# Altium project Evaluation Board.PrjPCB (part 2 of 3)

## Sheet RTC.SchDoc: Evaluation Board 3.2
size A3; Organization: Toradex AG; Address1: Altsagenstrasse 5; Address2: Horw; Address3: 6048; Address4: Switzerland; DocumentNumber: 5; Revision: V3.2; SheetNumber: 5; SheetTotal: 23; PageSetup: Record=PageOptions|CenterHorizontal=True|CenterVertical=True|PrintScale=0.73|XCorrection=1.00|YCorrection=1.00|PrintKind=0|BorderSize=5000000|LeftOffset=0|BottomOffset=0|Orientation=2|PaperLength=1000|PaperWidth=1000|Scale=100|PaperSource=7|PrintQuality=-4|MediaType=1|DitherType=10|PaperKind=A4|PrintScaleMode=1
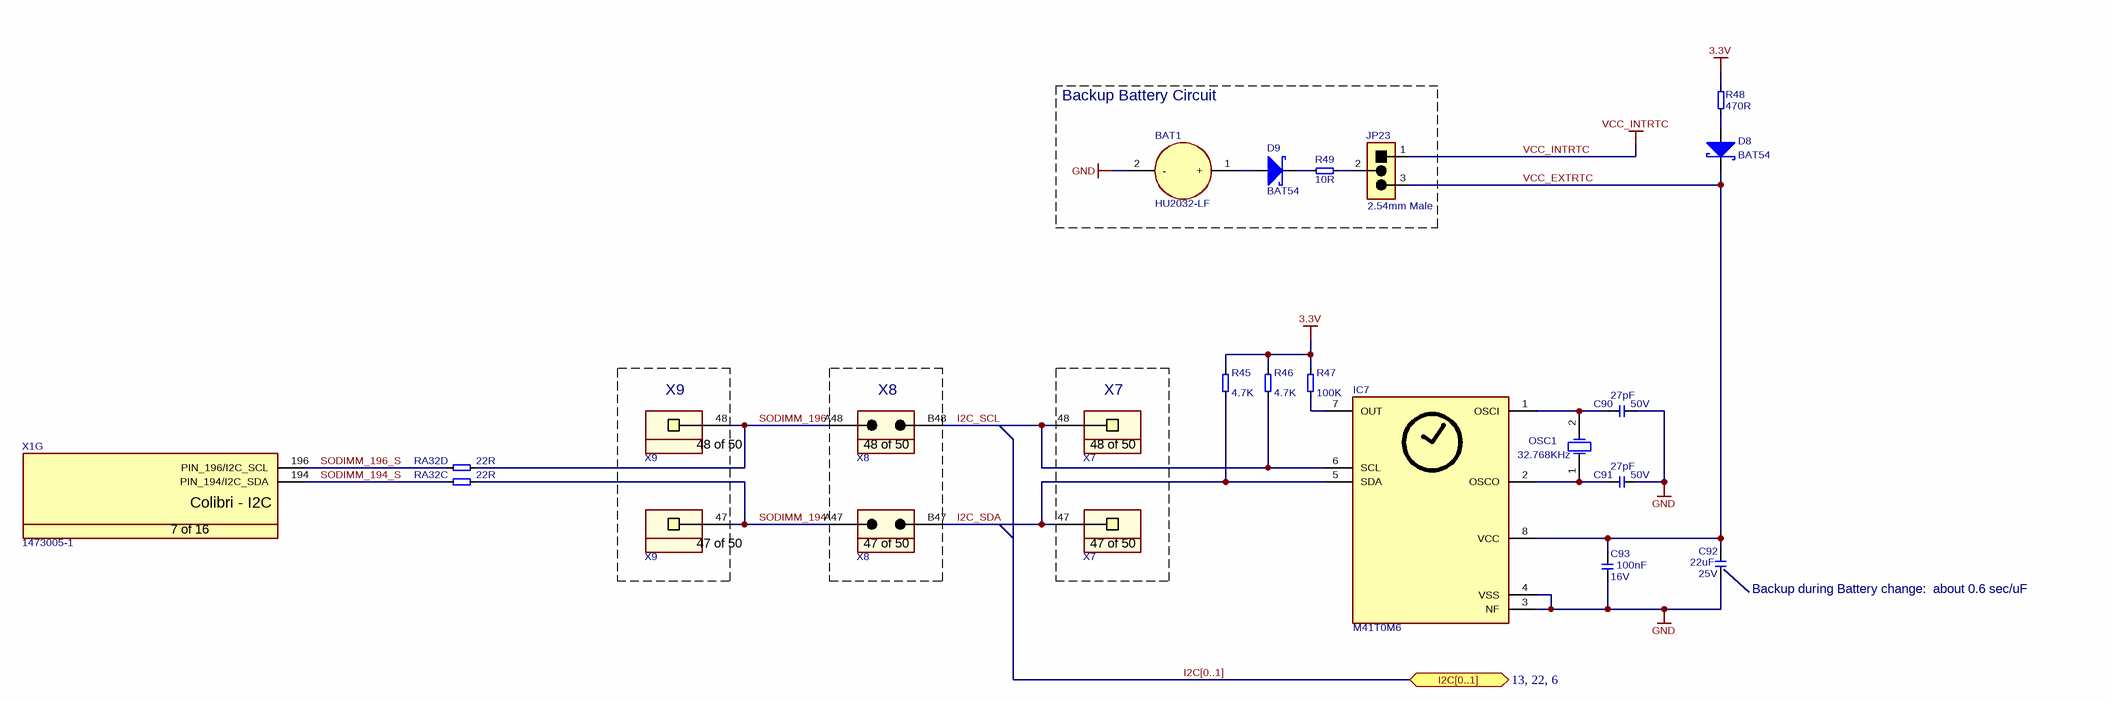
[diagram p8: RTC.SchDoc]

### Parts
BAT1  HU2032-LF  [T_Renata_HU2032-LF]
C90  Rating: 50V  [T_CAPC0603X33N]  (hidden comment: 27pF)
C91  Rating: 50V  [T_CAPC0603X33N]  (hidden comment: 27pF)
C92  Rating: 25V  [CAPC3225X160N]  (hidden comment: 22uF)
C93  Rating: 16V  [T_CAPC0603X33N]  (hidden comment: 100nF)
D8  BAT54  [SOT95P230X110-3N]
D9  BAT54  [SOT95P230X110-3N]
IC7  M41T0M6  [SOIC127P600X173-8N]
JP23  826936-3  [T_TYCO_826936-3]  (value not drawn)
OSC1  value 32.768KHz  [T_MC_CC4V-T1A]  (hidden comment: CC4V-T1A)
R45  4.7K  [t_RESC0603X30N]
R46  4.7K  [t_RESC0603X30N]
R47  100K  [t_RESC0603X30N]
R48  470R  [T_RESC0603X30N]
R49  10R  [t_RESC0603X30N]
RA32  22R  [T_Resistor_Array_X4]  (parts C,D of 4)
X1  Manufacturer Part No.: 1473005-1  [T_Tyco_1473005-1]  (hidden comment: CON-Tyco-1473005-1-200-0.6mm)  (part G of 16)
X7  SSW-110-01-G-S  [T_Samtec_SSW-110-01-G-S]  (value not drawn)  (parts 47,48 of 50)
X8  TSW-110-07-G-D  [T_Samtec_TSW-110-07-G-D]  (value not drawn)  (parts 47,48 of 50)
X9  SSW-110-01-G-S  [T_Samtec_SSW-110-01-G-S]  (value not drawn)  (parts 47,48 of 50)

### Blocks framed on the sheet
Backup Battery Circuit: BAT1 D9 JP23 R49
X9: X9
X8: X8
X7: X7

### Ports
I2C[0..1] (bidir, see 13, 22, 6)

### Nets
3.3V: R45.2 R46.2 R47.2 R48.2
GND: BAT1.2(-) C90.2 C91.2 C92.1 C93.1 IC7.3(NF) IC7.4(VSS)
VCC_INTRTC: JP23.1
I2C_SCL: IC7.6(SCL) R46.1 X7.48 X8.B48
I2C_SDA: IC7.5(SDA) R45.1 X7.47 X8.B47
SODIMM_194: RA32.7 X8.A47 X9.47
SODIMM_194_S: RA32.3 X1.194(PIN_194/I2C_SDA)
SODIMM_196: RA32.8 X8.A48 X9.48
SODIMM_196_S: RA32.4 X1.196(PIN_196/I2C_SCL)
VCC_EXTRTC: C92.2 C93.2 D8.3 IC7.8(VCC) JP23.3
NetBAT1_1: BAT1.1(+) D9.1
NetC90_1: C90.1 IC7.1(OSCI) OSC1.2(OSC2)
NetC91_1: C91.1 IC7.2(OSCO) OSC1.1(OSC1)
NetD8_1: D8.1 R48.1
NetD9_3: D9.3 R49.1
NetIC7_7: IC7.7(OUT) R47.1
NetJP23_2: JP23.2 R49.2

### Buses and harness runs
bus I2C[0..1] = port I2C[0..1]

### Notes on the sheet
- (near JP23) 2.54mm Male
- (near C92) Backup during Battery change:  about 0.6 sec/uF
- Title
- Size:
- Date:
- A3
- Number:
- Time:
- Revision:
- Sheet
- of
- File:
- (in symbol CON-Samtec-SSW-110-01-G-S, part 47) 47 of 50
- (in symbol CON-Samtec-SSW-110-01-G-S, part 48) 48 of 50
- (in symbol CON-Samtec-TSW-110-07-G-D, part 47) 47 of 50
- (in symbol CON-Samtec-TSW-110-07-G-D, part 48) 48 of 50
- (in symbol CON-Tyco-1473005-1-200-0.6mm, part G) Colibri - I2C; 7 of 16

### Library data of the parts
BAT1 = BAT-Renata-HU2032-LF: C2032 Battery Holder; Manufacturer Name: Renata; Manufacturer Part No.: HU2032-LF
C90 C91 = C-NPO-27pF-50V-5%-0603: Capacitor Ceramic NPO 27pF 50V 5% 0603; Tolerance: 5%; Type: NPO; Value: 27pF
C92 = C-X5R-22uF-25V-20%-1210: Capacitor Ceramic X5R 22uF 25V 20% 1210; Tolerance: 20%; Type: X5R; Value: 22uF
C93 = C-X7R-100nF-16V-10%-0603: Capacitor Ceramic X7R 100nF 16V 10% 0603; Tolerance: 10%; Type: X7R; Value: 100nF
D8 D9 = D-Philips-BAT54-Schottky: BAT54 Schottky Diode; Manufacturer Name: Philips; Manufacturer Part No.: BAT54
IC7 = IC-ST-M41T0M6: RTC M41T0M6; Manufacturer Name: ST; Manufacturer Part No.: M41T0M6
JP23 = CON-Tyco-826936-3-1X3-2.54mm-JP_1: Jumper, 3-Pin; Manufacturer Name: Tyco; No. of ways: 1X3; Pitch: 2.54mm; Manufacturer Part No.: 826936-3
OSC1 = OSC-MC-CC4V-T1A-32.768KHz-30ppm-5x1.9mm: Quartz 32.768kHz; Manufacturer Name: Micro Crystal; Tolerance: 30ppm; Manufacturer Part No.: CC4V-T1A
R45 R46 = R-4.7kR-63mW-5%-0603: Resistor 4.7 Kohm 63mW 5% 0603; Value: 4.7KR; Rating: 63mW; Tolerance: 5%
R47 = R-100KR-63mW-5%-0603: as R141 on sheet Extension; Rating: 63mW; Tolerance: 5%
R48 = R-470R-63mW-5%-0603: Resistor 470 ohm 63mW 5% 0603; Rating: 63mW; Tolerance: 5%; Value: 470R
R49 = R-10R-63mW-5%-0603: Resistor 10 ohm 63mW 5% 0603; Rating: 63mW; Tolerance: 5%; Value: 10R
RA32 = RA-22R-63mW-5%-1206-div: Resistor Array 22 R 63mW 5% 1206; Tolerance: 5%; Power Dissipation: 63mW; Value: 22R
X1 = CON-Tyco-1473005-1-200-0.6mm: as X1 on sheet Generic_Display
X7 X9 = CON-Samtec-SSW-110-01-G-S: as X10 on sheet SDCard; Pitch: 2.54mm; No. of ways: 1x50; Manufacturer Part No.: SSW-110-01-G-S
X8 = CON-Samtec-TSW-110-07-G-D: as X11 on sheet SDCard; Pitch: 2.54mm; No. of ways: 2x50; Manufacturer Part No.: TSW-110-07-G-D

## Sheet VGA.SchDoc: Evaluation Board 3.2
size A3; Organization: Toradex AG; Address1: Altsagenstrasse 5; Address2: Horw; Address3: 6048; Address4: Switzerland; DocumentNumber: 14; Revision: V3.2; SheetNumber: 14; SheetTotal: 23; PageSetup: Record=PageOptions|CenterHorizontal=True|CenterVertical=True|PrintScale=0.73|XCorrection=1.00|YCorrection=1.00|PrintKind=0|BorderSize=5000000|LeftOffset=0|BottomOffset=0|Orientation=2|PaperLength=1000|PaperWidth=1000|Scale=100|PaperSource=7|PrintQuality=-4|MediaType=1|DitherType=10|PaperKind=A4|PrintScaleMode=1
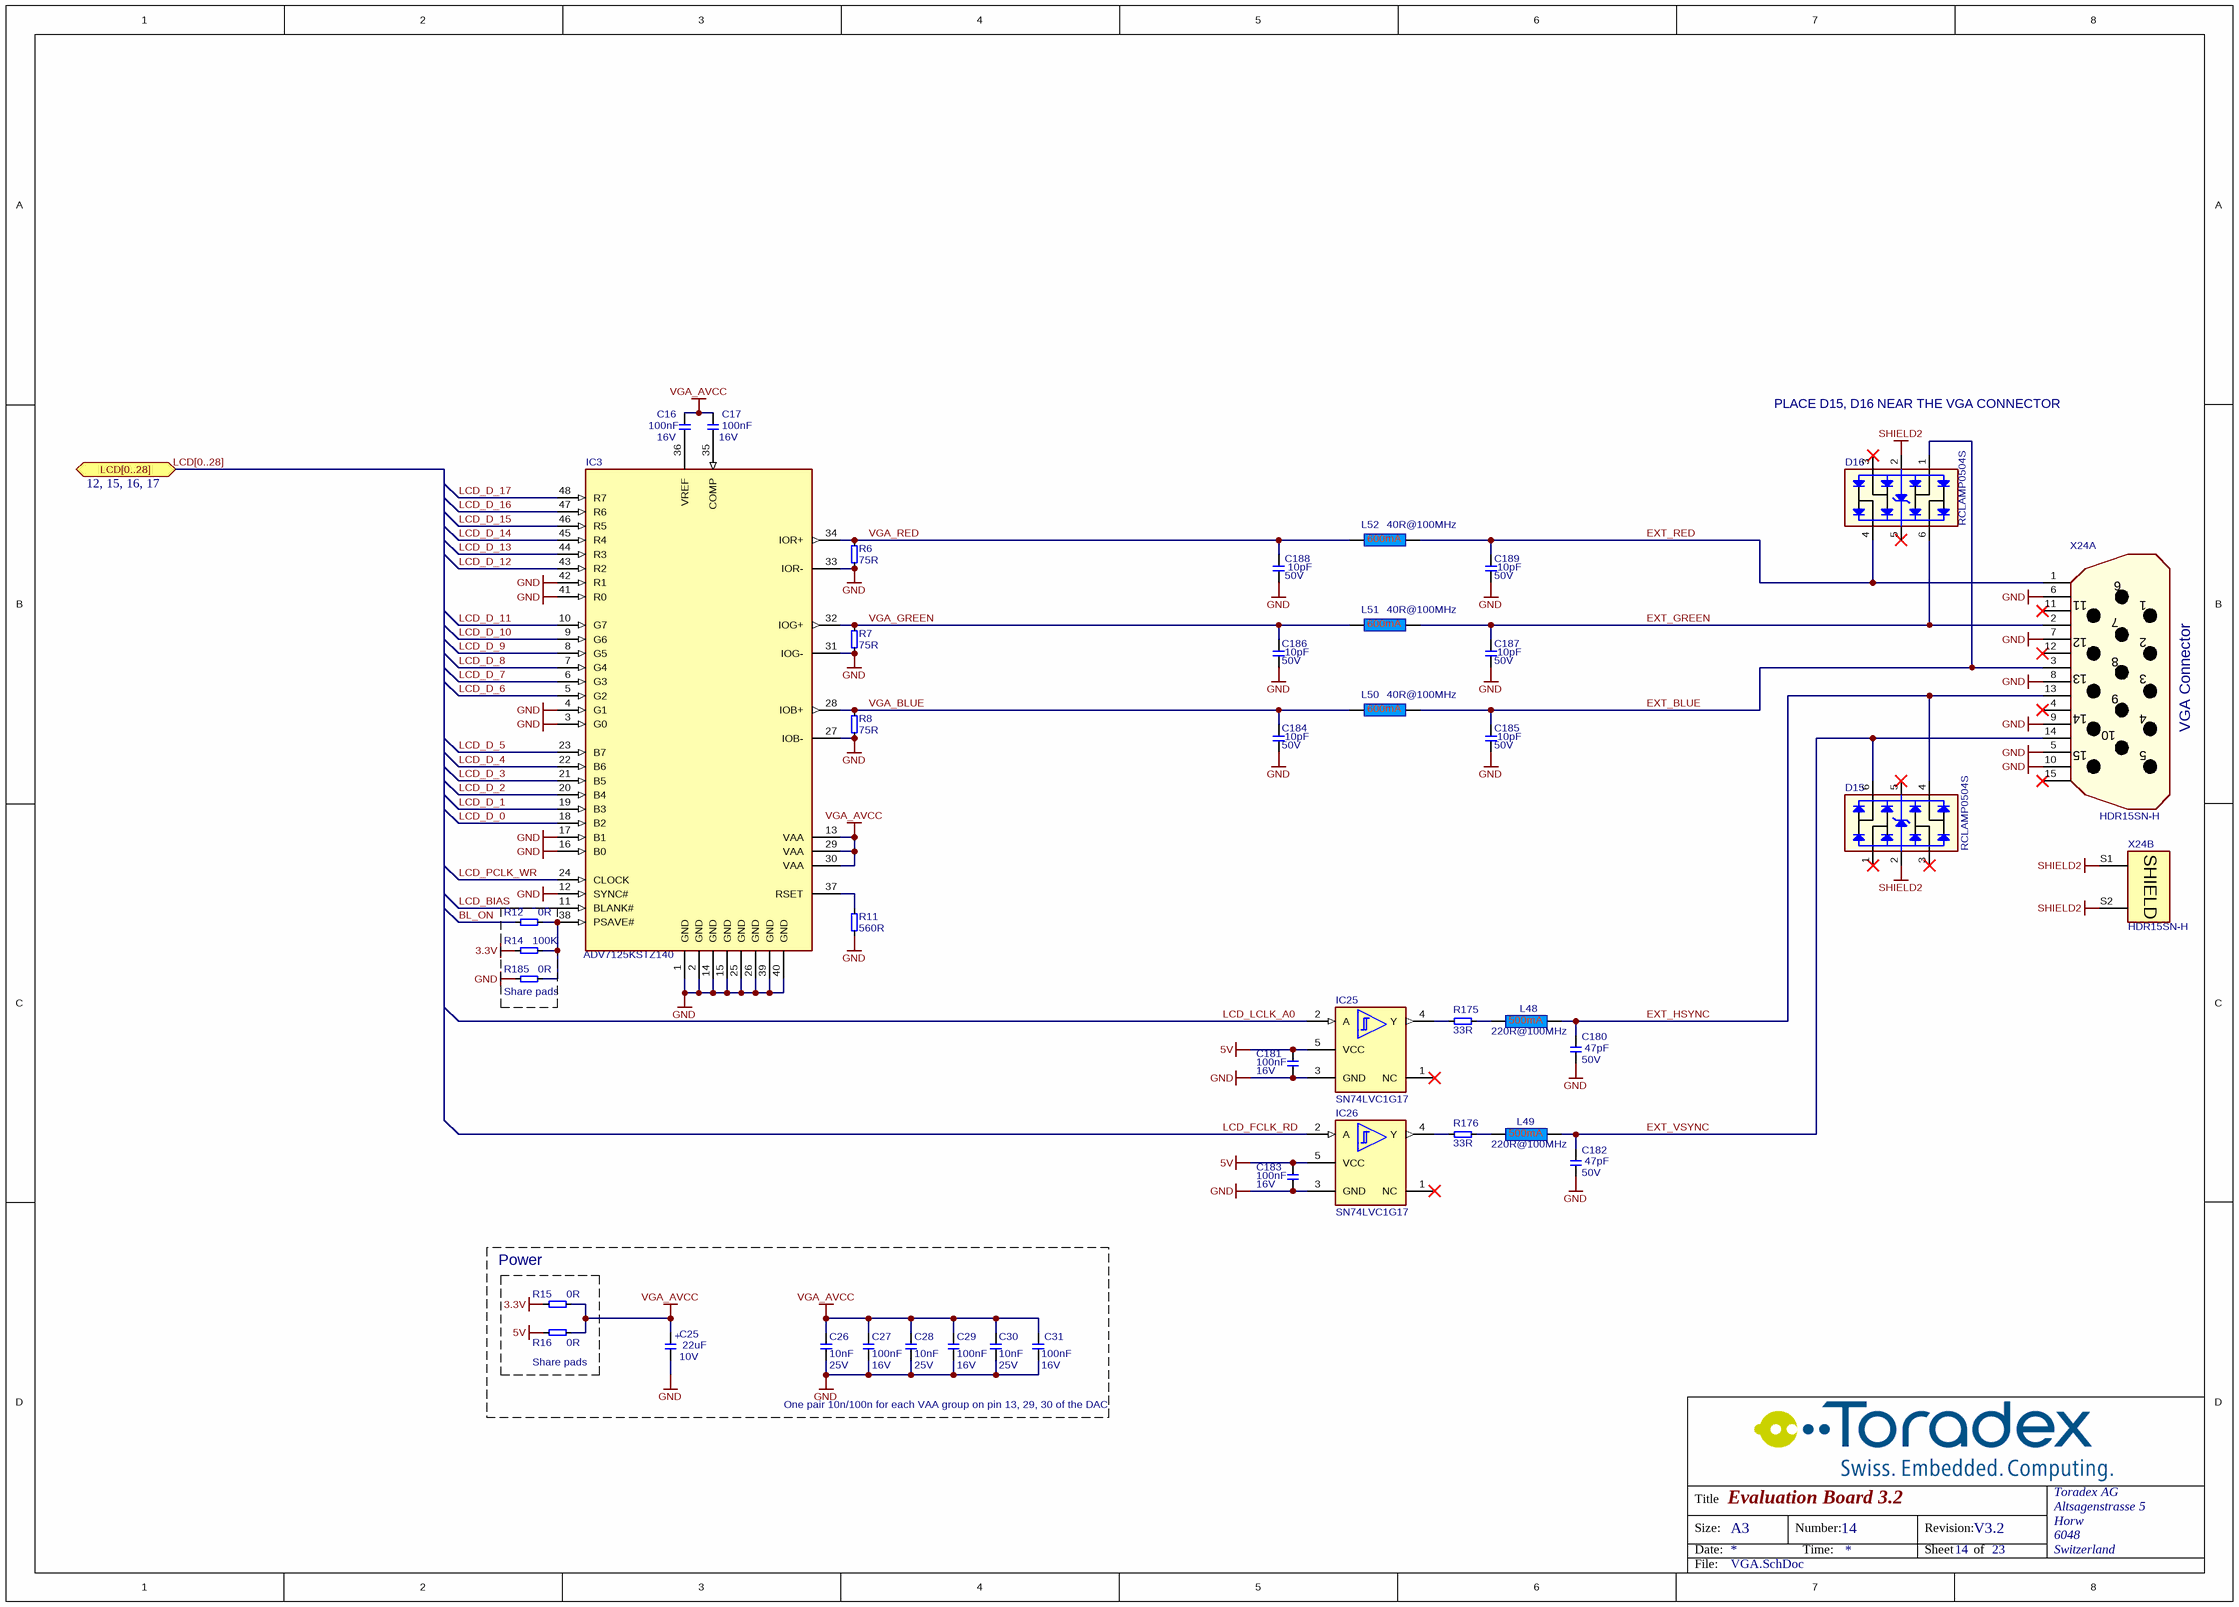
[diagram p9: VGA.SchDoc]

### Parts
C16  Rating: 16V  [T_CAPC0603X33N]  (hidden comment: 100nF)
C17  Rating: 16V  [T_CAPC0603X33N]  (hidden comment: 100nF)
C25  Rating: 10V  [CAPMP3528X210N]  (hidden comment: 22uF)
C26  Rating: 25V  [T_CAPC0603X33N]  (hidden comment: 10nF)
C27  Rating: 16V  [T_CAPC0603X33N]  (hidden comment: 100nF)
C28  Rating: 25V  [T_CAPC0603X33N]  (hidden comment: 10nF)
C29  Rating: 16V  [T_CAPC0603X33N]  (hidden comment: 100nF)
C30  Rating: 25V  [T_CAPC0603X33N]  (hidden comment: 10nF)
C31  Rating: 16V  [T_CAPC0603X33N]  (hidden comment: 100nF)
C180  Rating: 50V  [T_CAPC0603X33N]  (hidden comment: 47pF)
C181  Rating: 16V  [T_CAPC0603X33N]  (hidden comment: 100nF)
C182  Rating: 50V  [T_CAPC0603X33N]  (hidden comment: 47pF)
C183  Rating: 16V  [T_CAPC0603X33N]  (hidden comment: 100nF)
C184  Rating: 50V  [T_CAPC0603X33N]  (hidden comment: 10pF)
C185  Rating: 50V  [T_CAPC0603X33N]  (hidden comment: 10pF)
C186  Rating: 50V  [T_CAPC0603X33N]  (hidden comment: 10pF)
C187  Rating: 50V  [T_CAPC0603X33N]  (hidden comment: 10pF)
C188  Rating: 50V  [T_CAPC0603X33N]  (hidden comment: 10pF)
C189  Rating: 50V  [T_CAPC0603X33N]  (hidden comment: 10pF)
D15  RCLAMP0504S  [T_SOT95P285X90-6N]
D16  RCLAMP0504S  [T_SOT95P285X90-6N]
IC3  ADV7125KSTZ140  [QFP50P900X900X120-48N]
IC25  SN74LVC1G17  [SOT65P210X110-5N]
IC26  SN74LVC1G17  [SOT65P210X110-5N]
L48  220R@100MHz  [INDC1608X95N]
L49  220R@100MHz  [INDC1608X95N]
L50  40R@100MHz  [INDC1608X95N]
L51  40R@100MHz  [INDC1608X95N]
L52  40R@100MHz  [INDC1608X95N]
R6  75R  [T_RESC0603X30N]
R7  75R  [T_RESC0603X30N]
R8  75R  [T_RESC0603X30N]
R11  560R  [t_RESC0603X30N]
R12  0R  [T_RESC0603X30N]
R14  100K  [T_RESC0603X30N]
R15  0R  [T_RESC0603X30N]
R16  0R  [T_RESC0603X30N]
R175  33R  [t_RESC0603X30N]
R176  33R  [t_RESC0603X30N]
R185  0R  [t_RESC0603X30N]
X24  HDR15SN-H  [T_AUK_HDR15SN-H]  (parts A,B of 2)

### Blocks framed on the sheet
Share pads: R12 R14 R185
Share pads: C25-C31
Power: R15 R16

### Ports
LCD[0..28] (bidir, see 12, 15, 16, 17)

### Nets
3.3V: R14.1 R15.1
5V: C181.2 C183.2 IC25.5(VCC) IC26.5(VCC) R16.1
GND: C25.2 C26.1 C27.1 C28.1 C29.1 C30.1 C31.1 C180.2 C181.1 C182.2 C183.1 C184.2 C185.2 C186.2 C187.2 C188.2 C189.2 IC3.1(GND) IC3.2(GND) IC3.3(G0) IC3.4(G1) IC3.12(SYNC#) IC3.14(GND) IC3.15(GND) IC3.16(B0) IC3.17(B1) IC3.25(GND) IC3.26(GND) IC3.27(IOB-) IC3.31(IOG-) IC3.33(IOR-) IC3.39(GND) IC3.40(GND) IC3.41(R0) IC3.42(R1) IC25.3(GND) IC26.3(GND) R6.1 R7.1 R8.1 R11.1 R185.1 X24.5(GND) X24.6(DSR) X24.7(RTS) X24.8(CTS) X24.9(RI) X24.10(RI)
SHIELD2: D15.2 D16.2 X24.S1(SHIELD) X24.S2(SHIELD)
VGA_AVCC: C16.1 C17.1 C25.1 C26.2 C27.2 C28.2 C29.2 C30.2 C31.2 IC3.13(VAA) IC3.29(VAA) IC3.30(VAA) R15.2 R16.2
BL_ON: R12.1
EXT_BLUE: C185.1 D16.1 L50.2 X24.3(TXD)
EXT_GREEN: C187.1 D16.6 L51.2 X24.2(RXD)
EXT_HSYNC: C180.1 D15.4 L48.2 X24.13(RI)
EXT_RED: C189.1 D16.4 L52.2 X24.1(DCD)
EXT_VSYNC: C182.1 D15.6 L49.2 X24.14(RI)
LCD_BIAS: IC3.11(BLANK#)
LCD_D_0: IC3.18(B2)
LCD_D_1: IC3.19(B3)
LCD_D_2: IC3.20(B4)
LCD_D_3: IC3.21(B5)
LCD_D_4: IC3.22(B6)
LCD_D_5: IC3.23(B7)
LCD_D_6: IC3.5(G2)
LCD_D_7: IC3.6(G3)
LCD_D_8: IC3.7(G4)
LCD_D_9: IC3.8(G5)
LCD_D_10: IC3.9(G6)
LCD_D_11: IC3.10(G7)
LCD_D_12: IC3.43(R2)
LCD_D_13: IC3.44(R3)
LCD_D_14: IC3.45(R4)
LCD_D_15: IC3.46(R5)
LCD_D_16: IC3.47(R6)
LCD_D_17: IC3.48(R7)
LCD_FCLK_RD: IC26.2(A)
LCD_LCLK_A0: IC25.2(A)
LCD_PCLK_WR: IC3.24(CLOCK)
VGA_BLUE: C184.1 IC3.28(IOB+) L50.1 R8.2
VGA_GREEN: C186.1 IC3.32(IOG+) L51.1 R7.2
VGA_RED: C188.1 IC3.34(IOR+) L52.1 R6.2
NetC16_2: C16.2 IC3.36(VREF)
NetC17_2: C17.2 IC3.35(COMP)
NetIC3_37: IC3.37(RSET) R11.2
NetIC3_38: IC3.38(PSAVE#) R12.2 R14.2 R185.2
NetIC25_4: IC25.4(Y) R175.1
NetIC26_4: IC26.4(Y) R176.1
NetL48_1: L48.1 R175.2
NetL49_1: L49.1 R176.2

Not connected (* = marked no-connect by the designer): D15 1* 3* 5*; D16 3* 5*; IC25 1(NC)*; IC26 1(NC)*; X24 4(DTR)* 11(RI)* 12(RI)* 15(RI)*

### Buses and harness runs
bus LCD[0..28]

### Notes on the sheet
- (near D16) PLACE D15, D16 NEAR THE VGA CONNECTOR
- VGA Connector
- One pair 10n/100n for each VAA group on pin 13, 29, 30 of the DAC
- Labels drawn without touching a wire or pin: LCD[0..28]
- Title
- Size:
- Date:
- A3
- Number:
- Time:
- Revision:
- Sheet
- of
- File:
- (in symbol C-TA-22uF-10V-20%-3528) +

### Library data of the parts
C16 C17 C27 C29 C31 C181 C183 = C-X7R-100nF-16V-10%-0603: Capacitor Ceramic X7R 100nF 16V 10% 0603; Tolerance: 10%; Type: X7R; Value: 100nF
C25 = C-TA-22uF-10V-20%-3528: Capacitor TA 22uF 10V 20% 3528; Tolerance: 20%; Type: TA; Value: 22uF
C26 C28 C30 = C-X7R-10nF-25V-10%-0603: Capacitor Ceramic X7R 10nF 25V 10% 0603; Tolerance: 10%; Type: X7R; Value: 10nF
C180 C182 = C-NP0-47pF-50V-10%-0603: Capacitor Ceramic NP0 47pF 50V 10% 0603; Tolerance: 10%; Type: NP0; Value: 47pF
C184-C189 = C-NP0-10pF-50V-10%-0603: Capacitor Ceramic NP0 10pF 50V 10% 0603; Tolerance: 10%; Type: NP0; Value: 10pF
D15 D16 = D-Semtech-RClamp0504S: TVS Array low cap; Manufacturer Name: Semtech; Manufacturer Part No.: RCLAMP0504S
IC3 = IC-AD-ADV7125KSTZ140: Video DAC 8bit 140MHz; Manufacturer Name: Analog Devices; Manufacturer Part No.: ADV7125KSTZ140
IC25 IC26 = IC-TI-SN74LVC1G17: Single Schmitt-Trigger Buffer; Manufacturer Name: Texas Instruments; Manufacturer Part No.: SN74LVC1G17
L48 L49 = L-220R@100MHz-500mA-25%-0603: 220R@100MHz 500mA EMI FILTER; Tolerance: 25%; Rating: 500mA; Value: 220R@100MHz
L50-L52 = L-TDK-MMZ1608S400A-40R@100MHz-600mA-25%-0603: 40R@100MHz 600mA EMI FILTER; Manufacturer Name: TDK; Tolerance: 25%; Rating: 600mA; Manufacturer Part No.: MMZ1608S400A; Value: 40R@100MHz
R6-R8 = R-75R-63mW-1%-0603: Resistor 75 ohm 63mW 1% 0603; Rating: 63mW; Tolerance: 1%; Value: 75R
R11 = R-560R-63mW-5%-0603: Resistor 560 ohm 63mW 5% 0603; Rating: 63mW; Tolerance: 5%; Value: 560R
R12 R15 R16 R185 = R-0R-63mW-1%-0603: Resistor 0 ohm 63mW 1% 0603; Rating: 63mW; Tolerance: 1%; Value: 0R
R14 = R-100KR-63mW-5%-0603: Resistor 100 Kohm 63mW 5% 0603; Value: 100KR; Rating: 63mW; Tolerance: 5%
R175 R176 = R-33R-63mW-5%-0603: Resistor 33 ohm 63mW 5% 0603; Rating: 63mW; Tolerance: 5%; Value: 33R
X24 = CON-AUK-HDR15SN-H: 15 pin male D-SUB connector; Manufacturer Name: AUK; No. of ways: 15; Manufacturer Part No.: HDR15SN-H

## Sheet Analog_IOs.SCHDOC: Evaluation Board 3.2
size A3; Organization: Toradex AG; Address1: Altsagenstrasse 5; Address2: Horw; Address3: 6048; Address4: Switzerland; DocumentNumber: 11; Revision: V3.2; SheetNumber: 11; SheetTotal: 23; PageSetup: Record=PageOptions|CenterHorizontal=True|CenterVertical=True|PrintScale=0.73|XCorrection=1.00|YCorrection=1.00|PrintKind=0|BorderSize=5000000|LeftOffset=0|BottomOffset=0|Orientation=2|PaperLength=1000|PaperWidth=1000|Scale=100|PaperSource=7|PrintQuality=-4|MediaType=1|DitherType=10|PaperKind=A4|PrintScaleMode=1
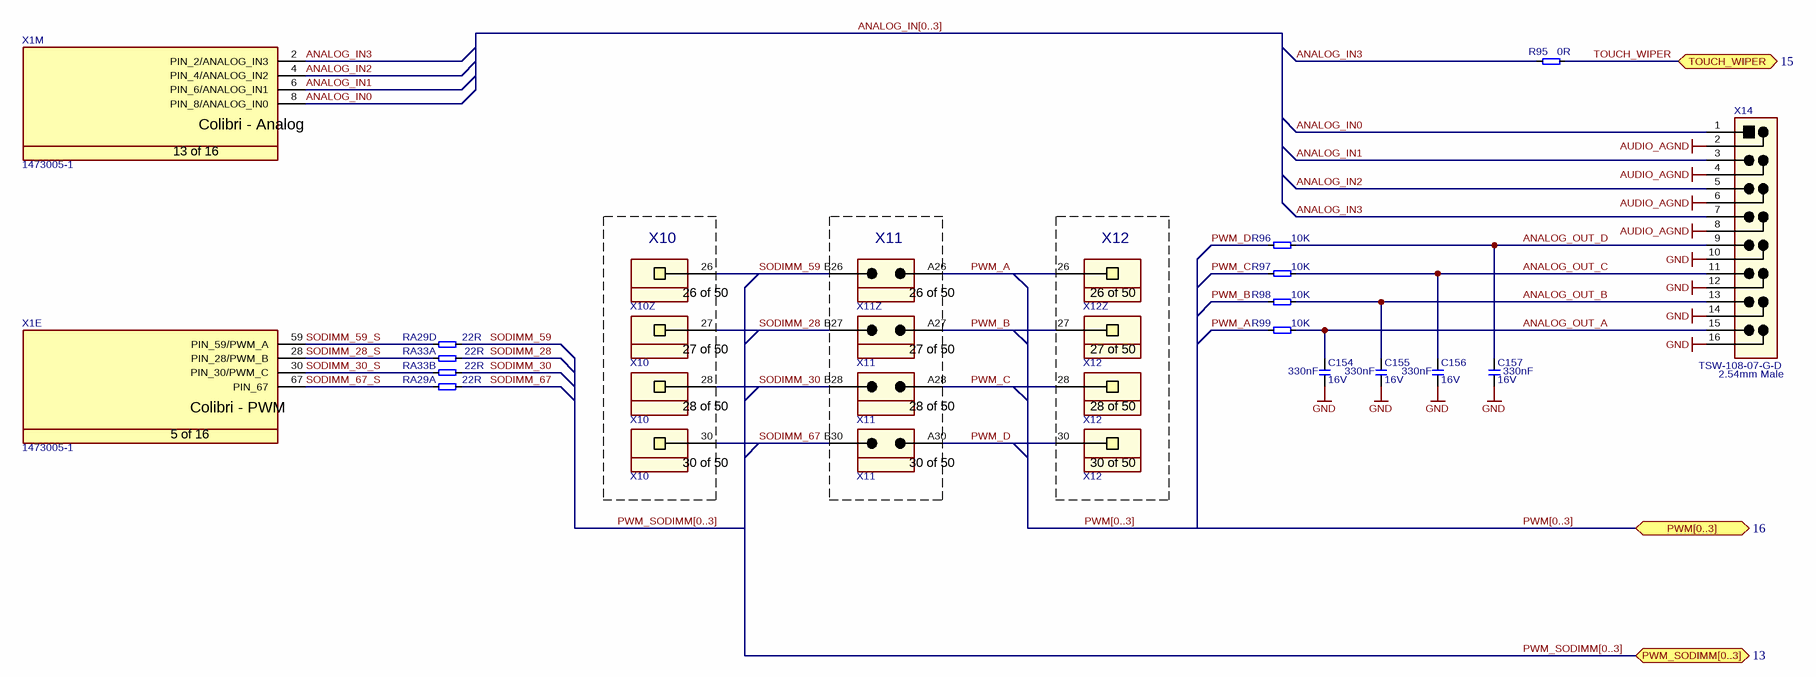
[diagram p10: Analog_IOs.SCHDOC]

### Parts
C154  Rating: 16V  [T_CAPC0805X125N]  (hidden comment: 330nF)
C155  Rating: 16V  [T_CAPC0805X125N]  (hidden comment: 330nF)
C156  Rating: 16V  [T_CAPC0805X125N]  (hidden comment: 330nF)
C157  Rating: 16V  [T_CAPC0805X125N]  (hidden comment: 330nF)
R95  0R  [T_RESC0603X30N]
R96  10K  [T_RESC0603X30N]
R97  10K  [T_RESC0603X30N]
R98  10K  [T_RESC0603X30N]
R99  10K  [T_RESC0603X30N]
RA29  22R  [T_Resistor_Array_X4]  (parts A,D of 4)
RA33  22R  [T_Resistor_Array_X4]  (parts A,B of 4)
X1  Manufacturer Part No.: 1473005-1  [T_Tyco_1473005-1]  (hidden comment: CON-Tyco-1473005-1-200-0.6mm)  (parts E,M of 16)
X10  SSW-110-01-G-S  [T_Samtec_SSW-110-01-G-S]  (value not drawn)  (parts Z,27,28,30 of 50)
X11  TSW-110-07-G-D  [T_Samtec_TSW-110-07-G-D]  (value not drawn)  (parts Z,27,28,30 of 50)
X12  SSW-110-01-G-S  [T_Samtec_SSW-110-01-G-S]  (value not drawn)  (parts Z,27,28,30 of 50)
X14  TSW-108-07-G-D  [T_Samtec_TSW-108-07-G-D]

### Blocks framed on the sheet
X10: X10
X11: X11
X12: X12

### Ports
PWM[0..3] (bidir, see 16), PWM_SODIMM[0..3] (bidir, see 13), TOUCH_WIPER (bidir, see 15)

### Nets
AUDIO_AGND: X14.2 X14.4 X14.6 X14.8
GND: C154.1 C155.1 C156.1 C157.1 X14.10 X14.12 X14.14 X14.16
ANALOG_IN0: X1.8(PIN_8/ANALOG_IN0) X14.1
ANALOG_IN1: X1.6(PIN_6/ANALOG_IN1) X14.3
ANALOG_IN2: X1.4(PIN_4/ANALOG_IN2) X14.5
ANALOG_IN3: R95.1 X1.2(PIN_2/ANALOG_IN3) X14.7
ANALOG_OUT_A: C154.2 R99.2 X14.15
ANALOG_OUT_B: C155.2 R98.2 X14.13
ANALOG_OUT_C: C156.2 R97.2 X14.11
ANALOG_OUT_D: C157.2 R96.2 X14.9
PWM_A: R99.1 X11.A26 X12.26
PWM_B: R98.1 X11.A27 X12.27
PWM_C: R97.1 X11.A28 X12.28
PWM_D: R96.1 X11.A30 X12.30
SODIMM_28: RA33.5 X10.27 X11.B27
SODIMM_28_S: RA33.1 X1.28(PIN_28/PWM_B)
SODIMM_30: RA33.6 X10.28 X11.B28
SODIMM_30_S: RA33.2 X1.30(PIN_30/PWM_C)
SODIMM_59: RA29.8 X10.26 X11.B26
SODIMM_59_S: RA29.4 X1.59(PIN_59/PWM_A)
SODIMM_67: RA29.5 X10.30 X11.B30
SODIMM_67_S: RA29.1 X1.67(PIN_67)
TOUCH_WIPER: R95.2 ; port TOUCH_WIPER

### Buses and harness runs
bus ANALOG_IN[0..3]
bus PWM[0..3] = port PWM[0..3]
bus PWM_SODIMM[0..3] = port PWM_SODIMM[0..3]

### Notes on the sheet
- (near X14) 2.54mm Male
- Title
- Size:
- Date:
- A3
- Number:
- Time:
- Revision:
- Sheet
- of
- File:
- (in symbol CON-Samtec-SSW-110-01-G-S, part Z) 26 of 50
- (in symbol CON-Samtec-SSW-110-01-G-S, part 27) 27 of 50
- (in symbol CON-Samtec-SSW-110-01-G-S, part 28) 28 of 50
- (in symbol CON-Samtec-SSW-110-01-G-S, part 30) 30 of 50
- (in symbol CON-Samtec-TSW-110-07-G-D, part Z) 26 of 50
- (in symbol CON-Samtec-TSW-110-07-G-D, part 27) 27 of 50
- (in symbol CON-Samtec-TSW-110-07-G-D, part 28) 28 of 50
- (in symbol CON-Samtec-TSW-110-07-G-D, part 30) 30 of 50
- (in symbol CON-Tyco-1473005-1-200-0.6mm, part E) Colibri - PWM; 5 of 16
- (in symbol CON-Tyco-1473005-1-200-0.6mm, part M) Colibri - Analog; 13 of 16

### Library data of the parts
C154-C157 = C-X7R-330nF-16V-10%-0805: Capacitor Ceramic X7R 330nF 16V 10% 0805; Tolerance: 10%; Type: X7R; Value: 330nF
R95 = R-0R-63mW-1%-0603: Resistor 0 ohm 63mW 1% 0603; Rating: 63mW; Tolerance: 1%; Value: 0R
R96-R99 = R-10KR-63mW-5%-0603: Resistor 10 Kohm 63mW 5% 0603; Value: 10KR; Rating: 63mW; Tolerance: 5%
RA29 RA33 = RA-22R-63mW-5%-1206-div: Resistor Array 22 R 63mW 5% 1206; Tolerance: 5%; Power Dissipation: 63mW; Value: 22R
X1 = CON-Tyco-1473005-1-200-0.6mm: SODIMM Connector; Manufacturer Name: Tyco; No. of ways: 200
X10 X12 = CON-Samtec-SSW-110-01-G-S: Header 1x50 pin 2.54mm pitch; Manufacturer Name: Samtec; Pitch: 2.54mm; No. of ways: 1x50; Manufacturer Part No.: SSW-110-01-G-S
X11 = CON-Samtec-TSW-110-07-G-D: Header 2x50 pin 2.54mm pitch; Manufacturer Name: Samtec; Pitch: 2.54mm; No. of ways: 2x50; Manufacturer Part No.: TSW-110-07-G-D
X14 = CON-Samtec-TSW-108-07-G-D: Header Male, 2x8 Pins, 2.54mm pitch; Manufacturer Name: Samtec; No. of ways: 2x8; Pitch: 2.54mm; Manufacturer Part No.: TSW-108-07-G-D

## Sheet Camera_Interface.SCHDOC: Evaluation Board 3.2
size A3; Organization: Toradex AG; Address1: Altsagenstrasse 5; Address2: Horw; Address3: 6048; Address4: Switzerland; DocumentNumber: 13; Revision: V3.2; SheetNumber: 13; SheetTotal: 23; PageSetup: Record=PageOptions|CenterHorizontal=True|CenterVertical=True|PrintScale=0.73|XCorrection=1.00|YCorrection=1.00|PrintKind=0|BorderSize=5000000|LeftOffset=0|BottomOffset=0|Orientation=2|PaperLength=1000|PaperWidth=1000|Scale=100|PaperSource=7|PrintQuality=-4|MediaType=1|DitherType=10|PaperKind=A4|PrintScaleMode=1
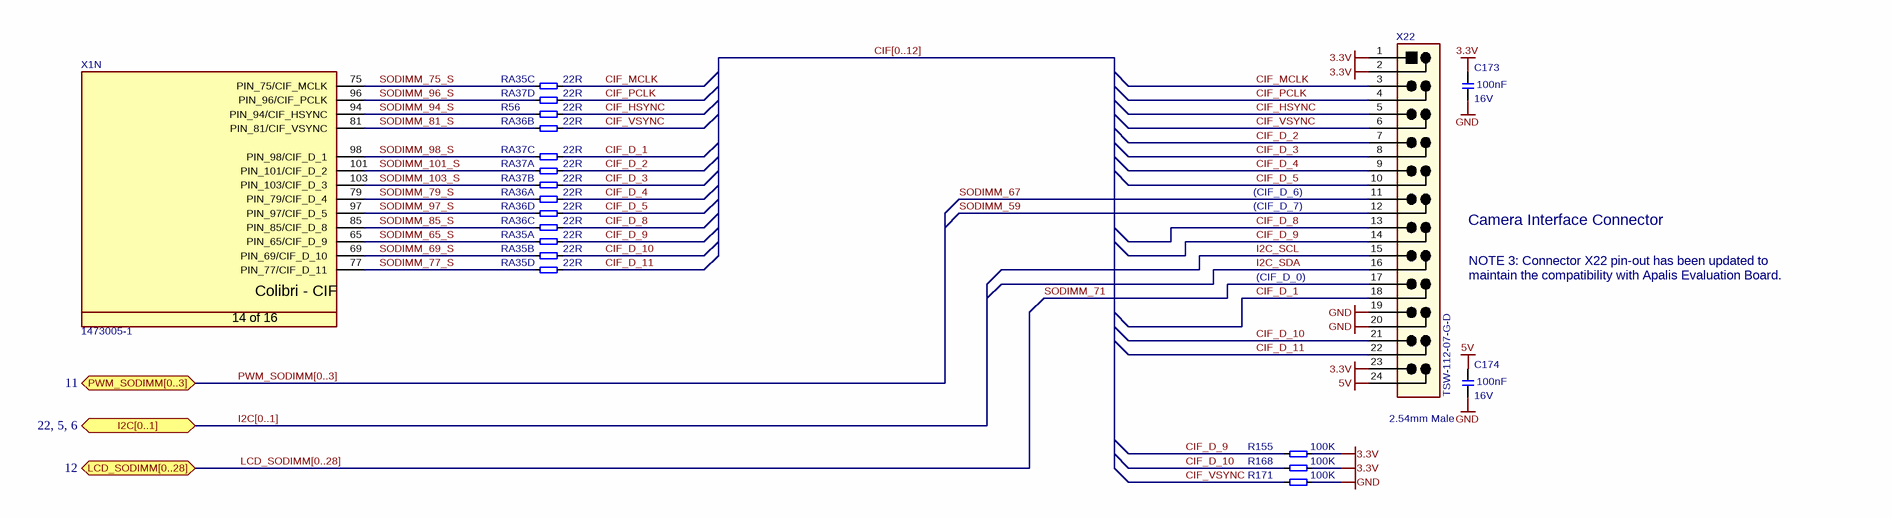
[diagram p11: Camera_Interface.SCHDOC]

### Parts
C173  Rating: 16V  [T_CAPC0603X33N]  (hidden comment: 100nF)
C174  Rating: 16V  [T_CAPC0603X33N]  (hidden comment: 100nF)
R56  22R  [RESC1005X40N]
R155  100K  [T_RESC0603X30N]
R168  100K  [T_RESC0603X30N]
R171  100K  [T_RESC0603X30N]
RA35  22R  [T_Resistor_Array_X4]  (parts A,B,C,D of 4)
RA36  22R  [T_Resistor_Array_X4]  (parts A,B,C,D of 4)
RA37  22R  [T_Resistor_Array_X4]  (parts A,B,C,D of 4)
X1  Manufacturer Part No.: 1473005-1  [T_Tyco_1473005-1]  (hidden comment: CON-Tyco-1473005-1-200-0.6mm)  (part N of 16)
X22  TSW-112-07-G-D  [T_Samtec_TSW-112-07-G-D]

### Ports
I2C[0..1] (bidir, see 22, 5, 6), LCD_SODIMM[0..28] (bidir, see 12), PWM_SODIMM[0..3] (bidir, see 11)

### Nets
3.3V: C173.2 R155.2 R168.2 X22.1 X22.2 X22.23
5V: C174.2 X22.24
GND: C173.1 C174.1 R171.2 X22.19 X22.20
CIF_D_1: RA37.7 X22.18
CIF_D_2: RA37.5 X22.7
CIF_D_3: RA37.6 X22.8
CIF_D_4: RA36.5 X22.9
CIF_D_5: RA36.8 X22.10
CIF_D_8: RA36.7 X22.13
CIF_D_9: R155.1 RA35.5 X22.14
CIF_D_10: R168.1 RA35.6 X22.21
CIF_D_11: RA35.8 X22.22
CIF_HSYNC: R56.2 X22.5
CIF_MCLK: RA35.7 X22.3
CIF_PCLK: RA37.8 X22.4
CIF_VSYNC: R171.1 RA36.6 X22.6
I2C_SCL: X22.15
I2C_SDA: X22.16
SODIMM_59: X22.12
SODIMM_65_S: RA35.1 X1.65(PIN_65/CIF_D_9)
SODIMM_67: X22.11
SODIMM_69_S: RA35.2 X1.69(PIN_69/CIF_D_10)
SODIMM_71: X22.17
SODIMM_75_S: RA35.3 X1.75(PIN_75/CIF_MCLK)
SODIMM_77_S: RA35.4 X1.77(PIN_77/CIF_D_11)
SODIMM_79_S: RA36.1 X1.79(PIN_79/CIF_D_4)
SODIMM_81_S: RA36.2 X1.81(PIN_81/CIF_VSYNC)
SODIMM_85_S: RA36.3 X1.85(PIN_85/CIF_D_8)
SODIMM_94_S: R56.1 X1.94(PIN_94/CIF_HSYNC)
SODIMM_96_S: RA37.4 X1.96(PIN_96/CIF_PCLK)
SODIMM_97_S: RA36.4 X1.97(PIN_97/CIF_D_5)
SODIMM_98_S: RA37.3 X1.98(PIN_98/CIF_D_1)
SODIMM_101_S: RA37.1 X1.101(PIN_101/CIF_D_2)
SODIMM_103_S: RA37.2 X1.103(PIN_103/CIF_D_3)

### Buses and harness runs
bus CIF[0..12]
bus I2C[0..1] = port I2C[0..1]
bus LCD_SODIMM[0..28] = port LCD_SODIMM[0..28]
bus PWM_SODIMM[0..3] = port PWM_SODIMM[0..3]

### Notes on the sheet
- (CIF_D_7)
- (CIF_D_6)
- Camera Interface Connector
- (CIF_D_0)
- NOTE 3: Connector X22 pin-out has been updated to
- maintain the compatibility with Apalis Evaluation Board.
- 2.54mm Male
- Title
- Size:
- Date:
- A3
- Number:
- Time:
- Revision:
- Sheet
- of
- File:
- (in symbol CON-Tyco-1473005-1-200-0.6mm, part N) Colibri - CIF; 14 of 16

### Library data of the parts
C173 C174 = C-X7R-100nF-16V-10%-0603: Capacitor Ceramic X7R 100nF 16V 10% 0603; Tolerance: 10%; Type: X7R; Value: 100nF
R56 = R-22R-63mW-5%-0402: Resistor 22 ohm 63mW 5% 0402; Rating: 63mW; Tolerance: 5%; Value: 22R
R155 R168 R171 = R-100KR-63mW-5%-0603: as R14 on sheet VGA; Rating: 63mW; Tolerance: 5%
RA35-RA37 = RA-22R-63mW-5%-1206-div: Resistor Array 22 R 63mW 5% 1206; Tolerance: 5%; Power Dissipation: 63mW; Value: 22R
X1 = CON-Tyco-1473005-1-200-0.6mm: as X1 on sheet Analog_IOs
X22 = CON-Samtec-TSW-112-07-G-D: Header male, 2x12 Pins, 2.54 mm pitch; Manufacturer Name: Samtec; Pitch: 2.54 mm; No. of ways: 2x12; Manufacturer Part No.: TSW-112-07-G-D

## Sheet Power_Switch.SchDoc: Evaluation Board 3.2
size A3; Organization: Toradex AG; Address1: Altsagenstrasse 5; Address2: Horw; Address3: 6048; Address4: Switzerland; DocumentNumber: 3; Revision: V3.2; SheetNumber: 3; SheetTotal: 23; PageSetup: Record=PageOptions|CenterHorizontal=True|CenterVertical=True|PrintScale=0.73|XCorrection=1.00|YCorrection=1.00|PrintKind=0|BorderSize=5000000|LeftOffset=0|BottomOffset=0|Orientation=2|PaperLength=1000|PaperWidth=1000|Scale=100|PaperSource=7|PrintQuality=-4|MediaType=1|DitherType=10|PaperKind=A4|PrintScaleMode=1
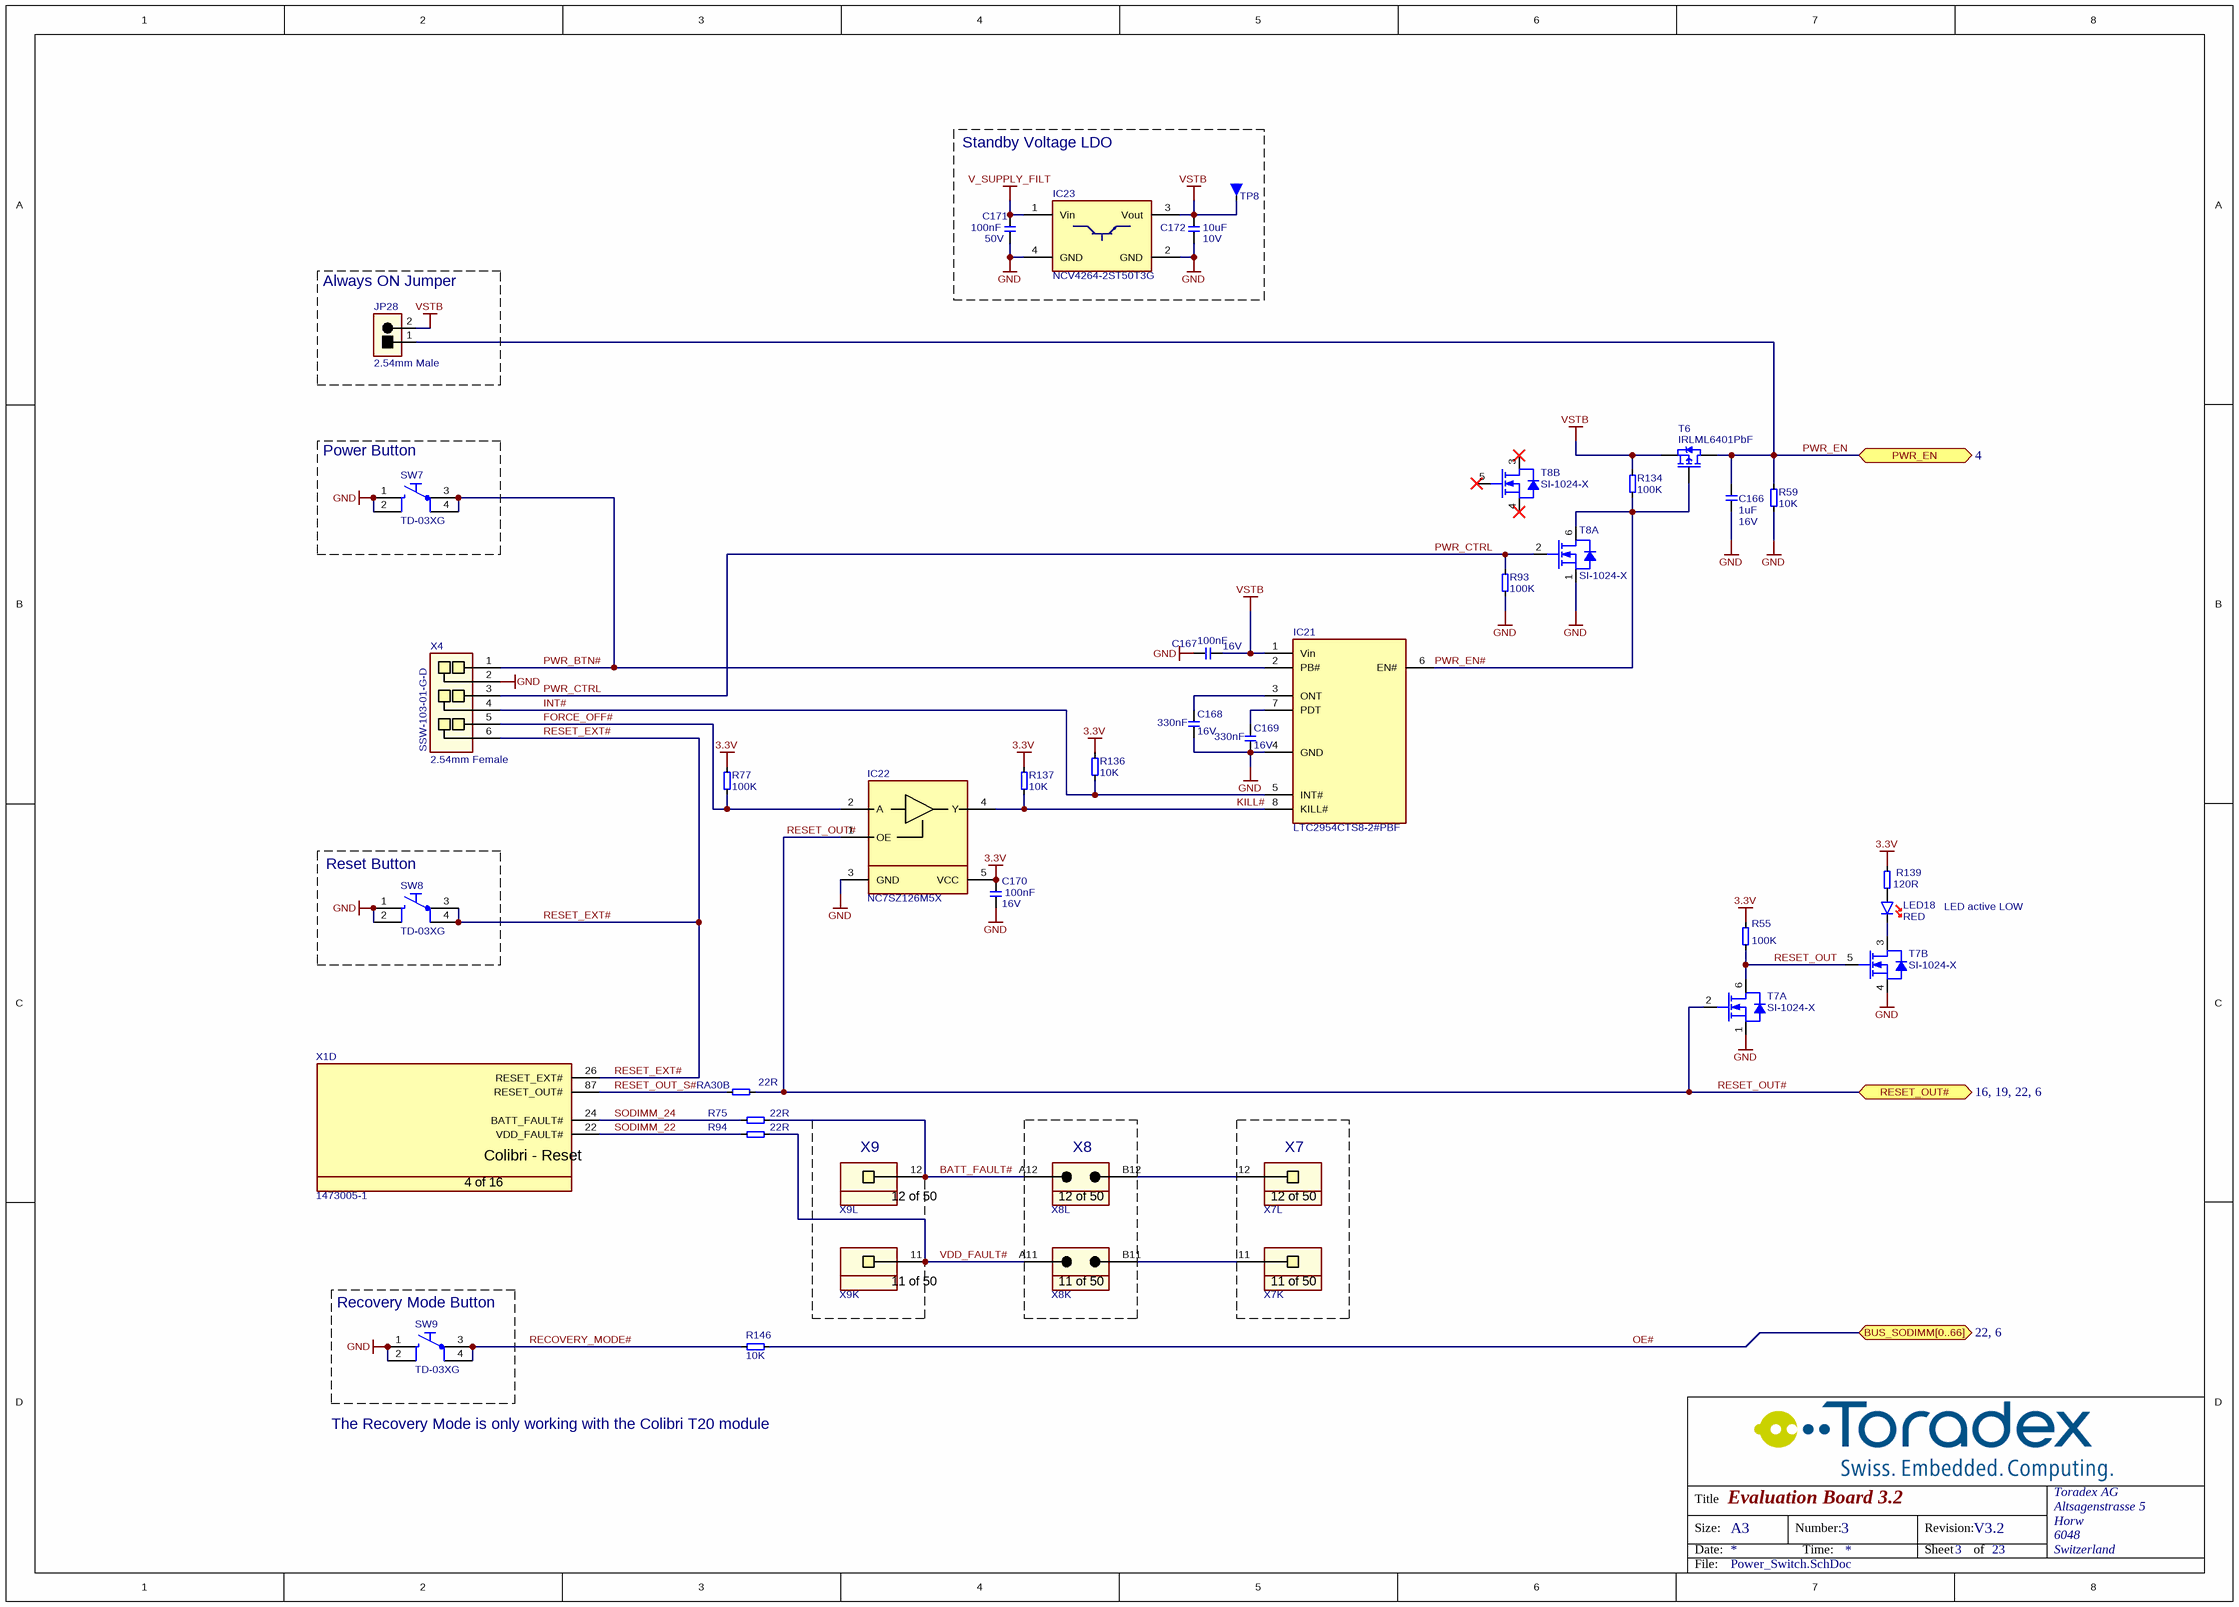
[diagram p12: Power_Switch.SchDoc]

### Parts
C166  Rating: 16V  [T_CAPC0603X33N]  (hidden comment: 1uF)
C167  Rating: 16V  [T_CAPC0603X33N]  (hidden comment: 100nF)
C168  Rating: 16V  [T_CAPC0805X125N]  (hidden comment: 330nF)
C169  Rating: 16V  [T_CAPC0805X125N]  (hidden comment: 330nF)
C170  Rating: 16V  [T_CAPC0603X33N]  (hidden comment: 100nF)
C171  Rating: 50V  [T_CAPC0603X33N]  (hidden comment: 100nF)
C172  Rating: 10V  [T_CAPC0805X125N]  (hidden comment: 10uF)
IC21  LTC2954CTS8-2#PBF  [T_LINEAR_LTC2954CTS8-2#PBF]
IC22  NC7SZ126M5X  [SOT95P279X142-5N]
IC23  NCV4264-2ST50T3G  [T_ON_NCV4264-2ST50T3G]
JP28  TSW-101-07-G-D  [T_Samtec_TSW-101-07-G-D]  (value not drawn)
LED18  Color: RED  [T_Osram_T670_RED]  (hidden comment: LS T670-K1L2-1)
R55  100K  [T_RESC0603X30N]
R59  10K  [T_RESC0603X30N]
R75  22R  [RESC1005X40N]
R77  100K  [T_RESC0603X30N]
R93  100K  [T_RESC0603X30N]
R94  22R  [RESC1005X40N]
R134  100K  [T_RESC0603X30N]
R136  10K  [T_RESC0603X30N]
R137  10K  [T_RESC0603X30N]
R139  120R  [T_RESC0603X30N]
R146  10K  [T_RESC0603X30N]
RA30  22R  [T_Resistor_Array_X4]  (part B of 4)
SW7  TD-03XG  [T_WMF_TD-03XG]
SW8  TD-03XG  [T_WMF_TD-03XG]
SW9  TD-03XG  [T_WMF_TD-03XG]
T6  IRLML6401PbF  [SOT95P237X112-3N]
T7  Manufacturer Part No.: SI-1024-X  [SOTFL50P160X60-6N]  (hidden comment: T-Vishay-SI-1024X-N)  (parts A,B of 2)
T8  Manufacturer Part No.: SI-1024-X  [SOTFL50P160X60-6N]  (hidden comment: T-Vishay-SI-1024X-N)  (parts A,B of 2)
TP8  Testpin  [T_TP-THT]  (value not drawn)
X1  Manufacturer Part No.: 1473005-1  [T_Tyco_1473005-1]  (hidden comment: CON-Tyco-1473005-1-200-0.6mm)  (part D of 16)
X4  Manufacturer Part No.: SSW-103-01-G-D  [T_Samtec_SSW-103-01-G-D]  (hidden comment: TSW-103-01-G-D)
X7  SSW-110-01-G-S  [T_Samtec_SSW-110-01-G-S]  (value not drawn)  (parts K,L of 50)
X8  TSW-110-07-G-D  [T_Samtec_TSW-110-07-G-D]  (value not drawn)  (parts K,L of 50)
X9  SSW-110-01-G-S  [T_Samtec_SSW-110-01-G-S]  (value not drawn)  (parts K,L of 50)

### Blocks framed on the sheet
Standby Voltage LDO: C171 C172 IC23 TP8
Always ON Jumper: JP28
Power Button: SW7
Reset Button: SW8
X9: X9
X8: X8
X7: X7
Recovery Mode Button: SW9

### Ports
BUS_SODIMM[0..66] (bidir, see 22, 6), PWR_EN (bidir, see 4), RESET_OUT# (bidir, see 16, 19, 22, 6)

### Nets
3.3V: C170.1 IC22.5(VCC) R55.2 R77.2 R136.1 R137.1 R139.2
GND: C166.1 C167.1 C168.1 C169.1 C170.2 C171.1 C172.1 IC21.4(GND) IC22.3(GND) IC23.2(GND) IC23.4(GND) R59.1 R93.1 SW7.1 SW7.2 SW8.1 SW8.2 SW9.1 SW9.2 T7.1(S) T7.4(S) T8.1(S) X4.2
V_SUPPLY_FILT: C171.2 IC23.1(Vin)
VSTB: C167.2 C172.2 IC21.1(Vin) IC23.3(Vout) JP28.2 R134.2 T6.2 TP8.1
BATT_FAULT#: R75.2 X8.A12 X9.12
FORCE_OFF#: IC22.2(A) R77.1 X4.5
INT#: IC21.5(INT#) R136.2 X4.4
KILL#: IC21.8(KILL#) IC22.4(Y) R137.2
OE#: R146.2
PWR_BTN#: IC21.2(PB#) SW7.3 SW7.4 X4.1
PWR_CTRL: R93.2 T8.2(G) X4.3
PWR_EN: C166.2 JP28.1 R59.2 T6.3 ; port PWR_EN
PWR_EN#: IC21.6(EN#) R134.1 T6.1 T8.6(D)
RECOVERY_MODE#: R146.1 SW9.3 SW9.4
RESET_EXT#: SW8.3 SW8.4 X1.26(RESET_EXT#) X4.6
RESET_OUT: R55.1 T7.5(G) T7.6(D)
RESET_OUT#: IC22.1(OE) RA30.6 T7.2(G) ; port RESET_OUT#
RESET_OUT_S#: RA30.2 X1.87(RESET_OUT#)
SODIMM_22: R94.1 X1.22(VDD_FAULT#)
SODIMM_24: R75.1 X1.24(BATT_FAULT#)
VDD_FAULT#: R94.2 X8.A11 X9.11
NetC168_2: C168.2 IC21.3(ONT)
NetC169_2: C169.2 IC21.7(PDT)
NetLED18_A: LED18.A R139.1
NetLED18_K: LED18.K T7.3(D)
NetX7_11: X7.11 X8.B11
NetX7_12: X7.12 X8.B12

Not connected (* = marked no-connect by the designer): T8 3(D)* 4(S)* 5(G)*

### Notes on the sheet
- (near JP28) 2.54mm Male
- (near X4) 2.54mm Female
- LED active LOW
- The Recovery Mode is only working with the Colibri T20 module
- Title
- Size:
- Date:
- A3
- Number:
- Time:
- Revision:
- Sheet
- of
- File:
- (in symbol CON-Samtec-SSW-110-01-G-S, part K) 11 of 50
- (in symbol CON-Samtec-SSW-110-01-G-S, part L) 12 of 50
- (in symbol CON-Samtec-TSW-110-07-G-D, part K) 11 of 50
- (in symbol CON-Samtec-TSW-110-07-G-D, part L) 12 of 50
- (in symbol CON-Tyco-1473005-1-200-0.6mm, part D) Colibri - Reset; 4 of 16

### Library data of the parts
C166 = C-X5R-1uF-16V-20%-0603: Capacitor Ceramic X5R 1uF 16V 20% 0603; Tolerance: 20%; Type: X5R; Value: 1uF
C167 C170 = C-X7R-100nF-16V-10%-0603: Capacitor Ceramic X7R 100nF 16V 10% 0603; Tolerance: 10%; Type: X7R; Value: 100nF
C168 C169 = C-X7R-330nF-16V-10%-0805: Capacitor Ceramic X7R 330nF 16V 10% 0805; Tolerance: 10%; Type: X7R; Value: 330nF
C171 = C-X7R-100nF-50V-20%-0603: Capacitor Ceramic X7R 100nF 50V 20% 0603; Tolerance: 20%; Type: X7R; Value: 100nF
C172 = C-X5R-10uF-10V-20%-0805: Capacitor Ceramic X5R 10uF 10V 20% 0805; Tolerance: 20%; Type: X5R; Value: 10uF
IC21 = IC-LIN-LTC2954CTS8-2#PBF: Push Button On/Off Controller; Manufacturer Name: Linear; Manufacturer Part No.: LTC2954CTS8-2#PBF
IC22 = IC-FAR-NC7SZ126M5X: NC7SZ126M5X  Buffer Three-State Output; Manufacturer Name: Fairchild Semiconductor; Manufacturer Part No.: NC7SZ126M5X
IC23 = IC-ON-NCV4264-2ST50T3G: NCV4264-2ST50T3G LDO Regulator; Manufacturer Name: ON Semiconductor; Manufacturer Part No.: NCV4264-2ST50T3G
JP28 = CON-Samtec-TSW-101-07-G-D: Header male, 1x2 Pins, 2.54 mm pitch; Manufacturer Name: Samtec; Pitch: 2.54 mm; No. of ways: 1x2; Manufacturer Part no.: TSW-101-07-G-D
LED18 = LED-Osram-LS T670-K1L2-1: LED red, Osram LS T670-K1L2-1; Manufacturer Part N.: LS T670-K1L2-1; Manufacturer Name: Osram
R55 R77 R93 R134 = R-100KR-63mW-5%-0603: as R14 on sheet VGA; Rating: 63mW; Tolerance: 5%
R59 R136 R137 R146 = R-10KR-63mW-5%-0603: as R96-R99 on sheet Analog_IOs; Rating: 63mW; Tolerance: 5%
R75 R94 = R-22R-63mW-5%-0402: Resistor 22 ohm 63mW 5% 0402; Rating: 63mW; Tolerance: 5%; Value: 22R
R139 = R-120R-63mW-5%-0603: Resistor 120 ohm 63mW 5% 0603; Rating: 63mW; Tolerance: 5%; Value: 120R
RA30 = RA-22R-63mW-5%-1206-div: Resistor Array 22 R 63mW 5% 1206; Tolerance: 5%; Power Dissipation: 63mW; Value: 22R
SW7-SW9 = SW-WMF-TD-03XG: Switch; Manufacturer Name: WMF; Rating: 50mA; Manufacturer Part No.: TD-03XG
T6 = T-IR-IRLML6401PbF-SOT-23: p-channel MOSFET, IRLML6401PbF; Manufacturer Name: International Rectifier; Manufacturer Part No.: IRLML6401PbF
T7 T8 = T-Vishay-SI-1024X-N: Dual N-Channel 20V (D-S)  MOSFET; Manufacturer Name: Vishay
TP8 = Testpin: Testpin TH
X1 = CON-Tyco-1473005-1-200-0.6mm: as X1 on sheet Analog_IOs
X4 = CON-Samtec-SSW-103-01-G-D: Header Female, 2x3 Pins, 2.54mm pitch; Manufacturer Name: Samtec; No. of ways: 2x3; Pitch: 2.54mm
X7 X9 = CON-Samtec-SSW-110-01-G-S: as X10 on sheet Analog_IOs; Pitch: 2.54mm; No. of ways: 1x50; Manufacturer Part No.: SSW-110-01-G-S
X8 = CON-Samtec-TSW-110-07-G-D: as X11 on sheet Analog_IOs; Pitch: 2.54mm; No. of ways: 2x50; Manufacturer Part No.: TSW-110-07-G-D

## Sheet CAN.SchDoc: Evaluation Board 3.2
size A3; Organization: Toradex AG; Address1: Altsagenstrasse 5; Address2: Horw; Address3: 6048; Address4: Switzerland; DocumentNumber: 19; Revision: V3.2; SheetNumber: 19; SheetTotal: 23; PageSetup: Record=PageOptions|CenterHorizontal=True|CenterVertical=True|PrintScale=0.73|XCorrection=1.00|YCorrection=1.00|PrintKind=0|BorderSize=5000000|LeftOffset=0|BottomOffset=0|Orientation=2|PaperLength=1000|PaperWidth=1000|Scale=100|PaperSource=7|PrintQuality=-4|MediaType=1|DitherType=10|PaperKind=A4|PrintScaleMode=1
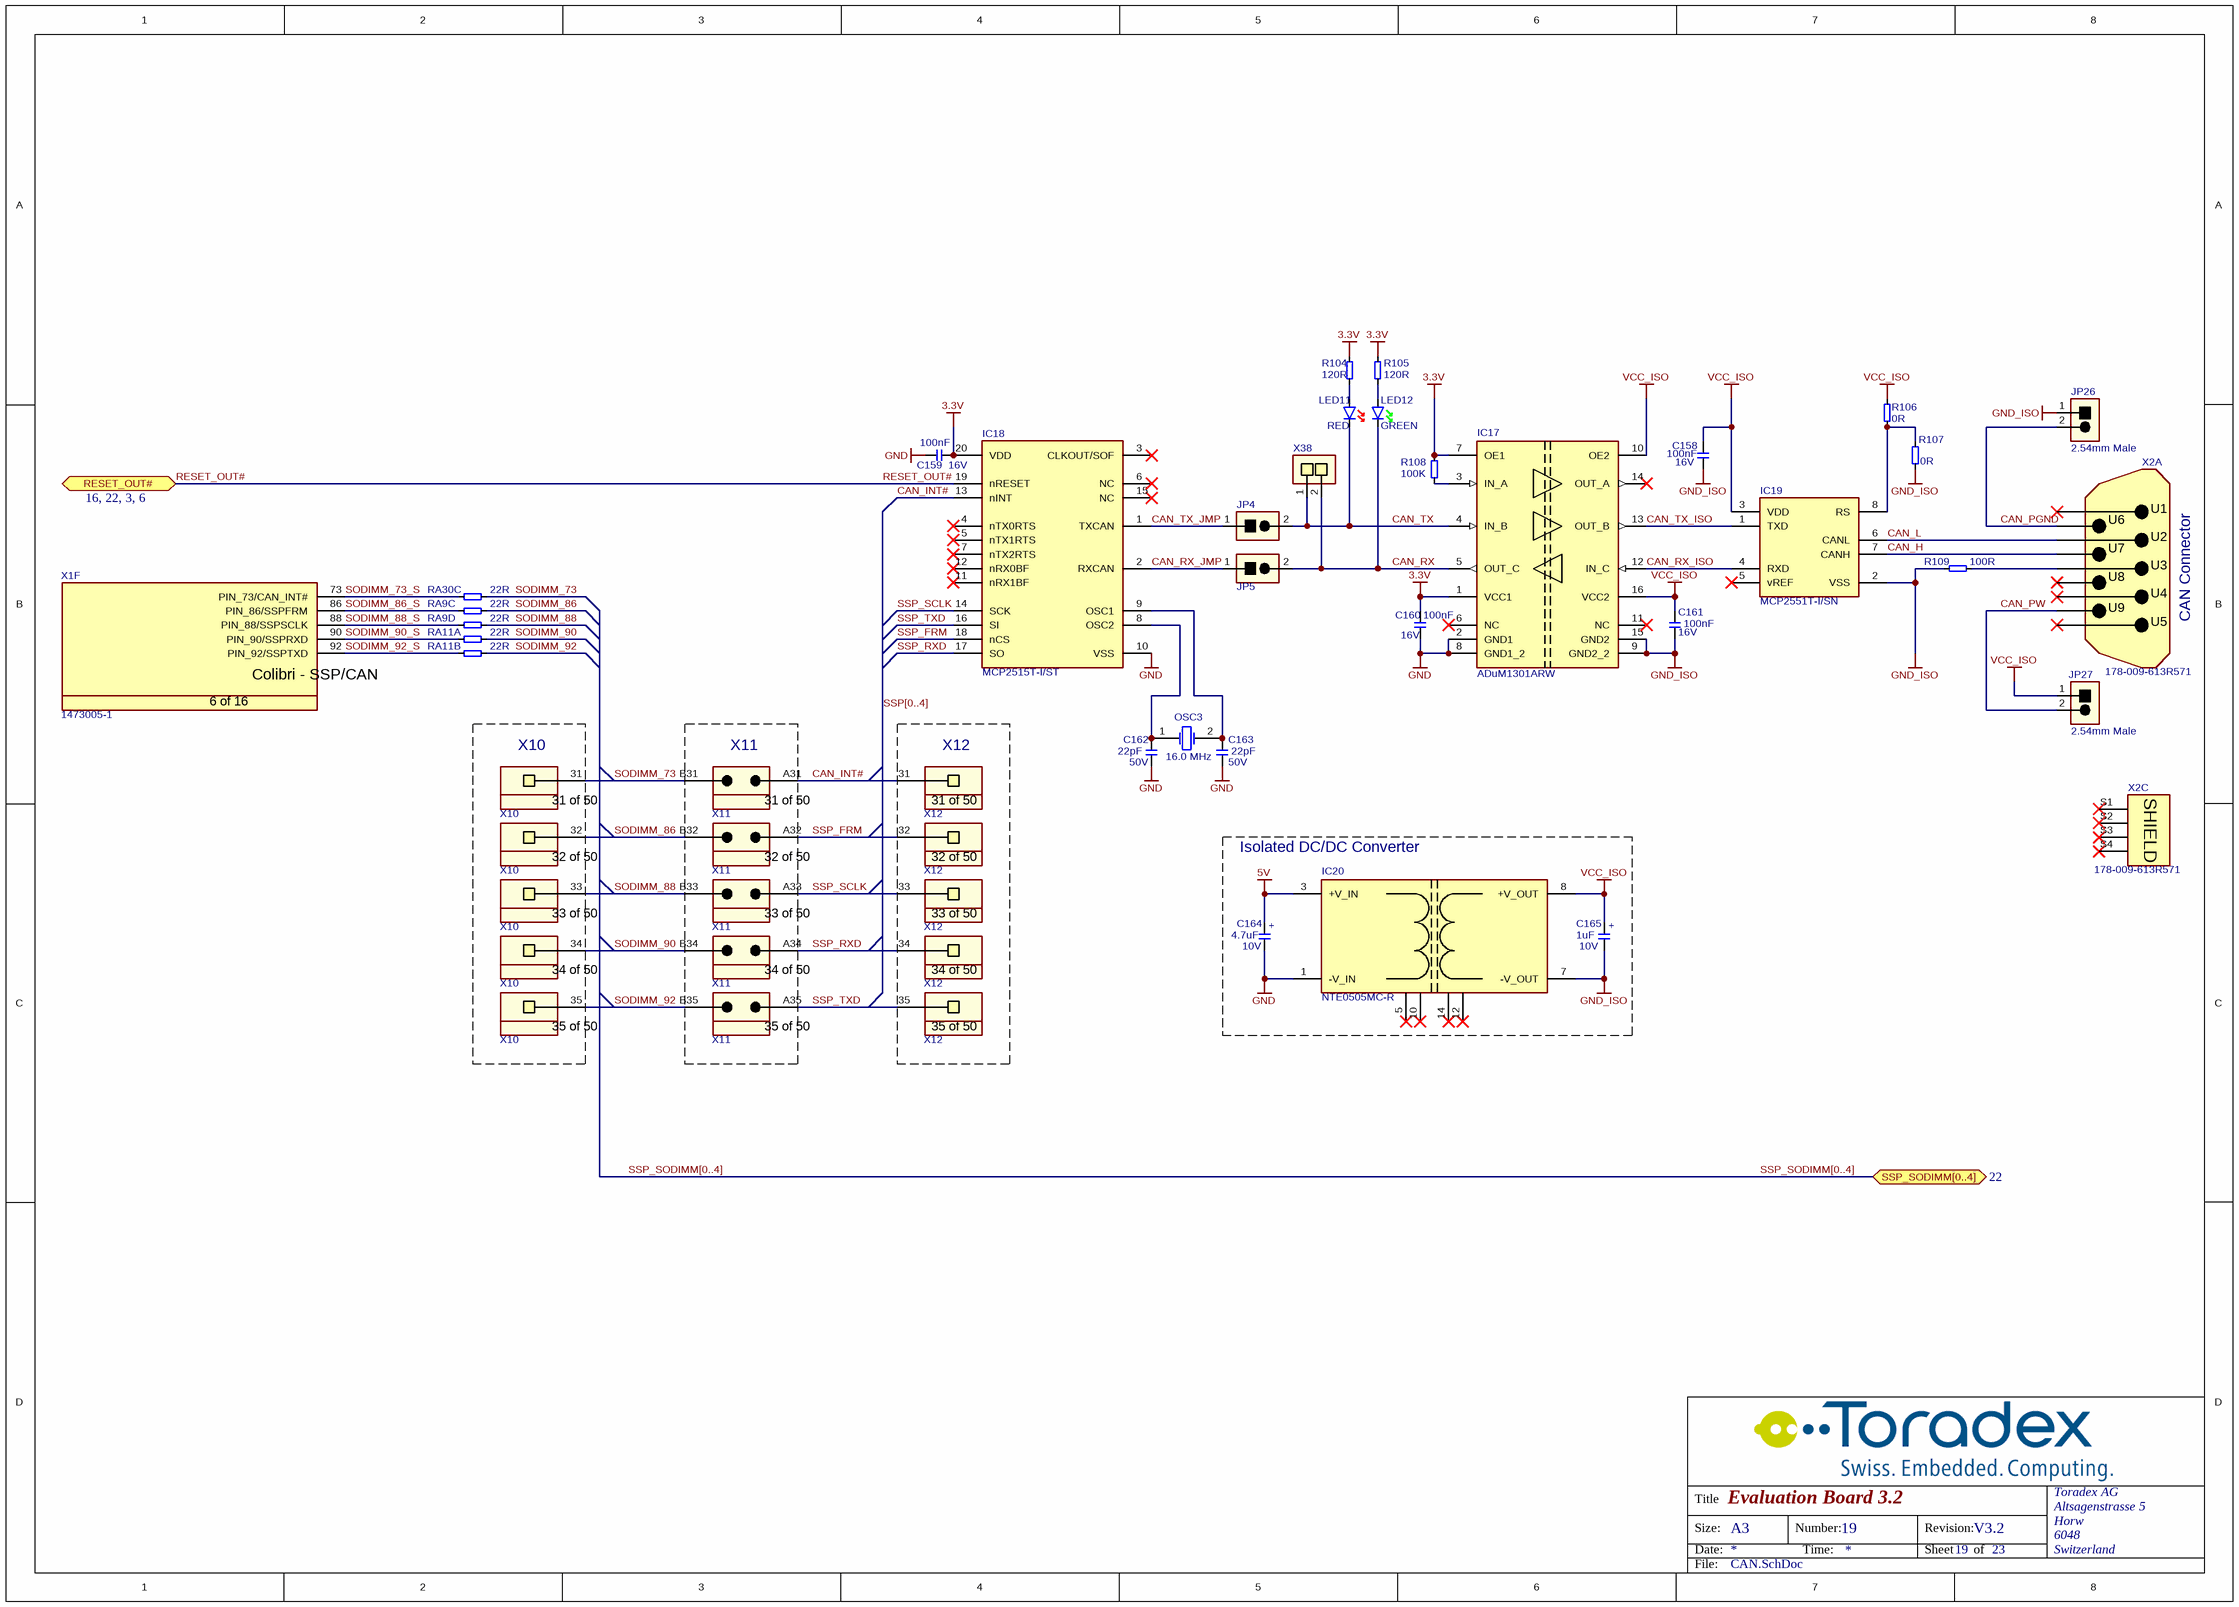
[diagram p13: CAN.SchDoc]

### Parts
C158  Rating: 16V  [T_CAPC0603X33N]  (hidden comment: 100nF)
C159  Rating: 16V  [T_CAPC0603X33N]  (hidden comment: 100nF)
C160  Rating: 16V  [T_CAPC0603X33N]  (hidden comment: 100nF)
C161  Rating: 16V  [T_CAPC0603X33N]  (hidden comment: 100nF)
C162  Rating: 50V  [T_CAPC0603X33N]  (hidden comment: 22pF)
C163  Rating: 50V  [T_CAPC0603X33N]  (hidden comment: 22pF)
C164  Rating: 10V  [T_CAPMP3216X180N]  (hidden comment: 4.7uF)
C165  Rating: 10V  [T_CAPMP3216X180N]  (hidden comment: 1uF)
IC17  ADuM1301ARW  [T_AD_ADuM1300ARW]
IC18  Manufacturer Part No.: MCP2515T-I/ST  [T_MC_MCP2515T-I/ST]  (hidden comment: MCP2515)
IC19  MCP2551T-I/SN  [SOIC127P600X173-8N]
IC20  NTE0505MC-R  [T_MURATA_NTE0505MC-R]
JP4  TSW-101-07-G-D  [T_Samtec_TSW-101-07-G-D]  (value not drawn)
JP5  TSW-101-07-G-D  [T_Samtec_TSW-101-07-G-D]  (value not drawn)
JP26  TSW-101-07-G-D  [T_Samtec_TSW-101-07-G-D]  (value not drawn)
JP27  TSW-101-07-G-D  [T_Samtec_TSW-101-07-G-D]  (value not drawn)
LED11  Color: RED  [T_Osram_T670_RED]  (hidden comment: LS T670-K1L2-1)
LED12  Color: GREEN  [T_Osram_T670_GREEN]  (hidden comment: LG T670-K1L2-1)
OSC3  value 16.0 MHz  [T_RAKON_12SMX]  (hidden comment: 12SMX (B) 30/5020/16)
R104  120R  [T_RESC0603X30N]
R105  120R  [T_RESC0603X30N]
R106  0R  [T_RESC0603X30N]
R107  0R  [T_RESC0603X30N]
R108  100K  [T_RESC0603X30N]
R109  100R  [T_RESC0603X30N]
RA9  22R  [T_Resistor_Array_X4]  (parts C,D of 4)
RA11  22R  [T_Resistor_Array_X4]  (parts A,B of 4)
RA30  22R  [T_Resistor_Array_X4]  (part C of 4)
X1  Manufacturer Part No.: 1473005-1  [T_Tyco_1473005-1]  (hidden comment: CON-Tyco-1473005-1-200-0.6mm)  (part F of 16)
X2  178-009-613R571  [T_NorComp_178-YYY-613R691]  (parts A,C of 3)
X10  SSW-110-01-G-S  [T_Samtec_SSW-110-01-G-S]  (value not drawn)  (parts 31,32,33,34,35 of 50)
X11  TSW-110-07-G-D  [T_Samtec_TSW-110-07-G-D]  (value not drawn)  (parts 31,32,33,34,35 of 50)
X12  SSW-110-01-G-S  [T_Samtec_SSW-110-01-G-S]  (value not drawn)  (parts 31,32,33,34,35 of 50)
X38  SSW-102-01-G-S  [T_Samtec_SSW-102-01-G-S]  (value not drawn)

### Blocks framed on the sheet
X10: X10
X11: X11
X12: X12
Isolated DC/DC Converter: C164 C165 IC20

### Ports
RESET_OUT# (bidir, see 16, 22, 3, 6), SSP_SODIMM[0..4] (bidir, see 22)

### Nets
3.3V: C159.1 C160.2 IC17.1(VCC1) IC17.7(OE1) IC18.20(VDD) R104.1 R105.1 R108.2
5V: C164.1 IC20.3(+V_IN)
GND: C159.2 C160.1 C162.1 C163.1 C164.2 IC17.2(GND1) IC17.8(GND1_2) IC18.10(VSS) IC20.1(-V_IN)
GND_ISO: C158.1 C161.1 C165.2 IC17.9(GND2_2) IC17.15(GND2) IC19.2(VSS) IC20.7(-V_OUT) JP26.1 R107.1 R109.2
VCC_ISO: C158.2 C161.2 C165.1 IC17.10(OE2) IC17.16(VCC2) IC19.3(VDD) IC20.8(+V_OUT) JP27.1 R106.2
CAN_H: IC19.7(CANH) X2.U7(RTS)
CAN_INT#: IC18.13(nINT) X11.A31 X12.31
CAN_L: IC19.6(CANL) X2.U2(RXD)
CAN_PGND: JP26.2 X2.U6(DSR)
CAN_PW: JP27.2 X2.U9(RI)
CAN_RX: IC17.5(OUT_C) JP5.2 LED12.K X38.2
CAN_RX_ISO: IC17.12(IN_C) IC19.4(RXD)
CAN_RX_JMP: IC18.2(RXCAN) JP5.1
CAN_TX: IC17.4(IN_B) JP4.2 LED11.K X38.1
CAN_TX_ISO: IC17.13(OUT_B) IC19.1(TXD)
CAN_TX_JMP: IC18.1(TXCAN) JP4.1
RESET_OUT#: IC18.19(nRESET) ; port RESET_OUT#
SODIMM_73: RA30.7 X10.31 X11.B31
SODIMM_73_S: RA30.3 X1.73(PIN_73/CAN_INT#)
SODIMM_86: RA9.7 X10.32 X11.B32
SODIMM_86_S: RA9.3 X1.86(PIN_86/SSPFRM)
SODIMM_88: RA9.8 X10.33 X11.B33
SODIMM_88_S: RA9.4 X1.88(PIN_88/SSPSCLK)
SODIMM_90: RA11.5 X10.34 X11.B34
SODIMM_90_S: RA11.1 X1.90(PIN_90/SSPRXD)
SODIMM_92: RA11.6 X10.35 X11.B35
SODIMM_92_S: RA11.2 X1.92(PIN_92/SSPTXD)
SSP_FRM: IC18.18(nCS) X11.A32 X12.32
SSP_RXD: IC18.17(SO) X11.A34 X12.34
SSP_SCLK: IC18.14(SCK) X11.A33 X12.33
SSP_TXD: IC18.16(SI) X11.A35 X12.35
NetC162_2: C162.2 IC18.8(OSC2) OSC3.1(OSC1)
NetC163_2: C163.2 IC18.9(OSC1) OSC3.2(OSC2)
NetIC17_3: IC17.3(IN_A) R108.1
NetIC19_8: IC19.8(RS) R106.1 R107.2
NetLED11_A: LED11.A R104.2
NetLED12_A: LED12.A R105.2
NetR109_1: R109.1 X2.U3(TXD)

Not connected (* = marked no-connect by the designer): IC17 6(NC)* 11(NC)* 14(OUT_A)*; IC18 3(CLKOUT/SOF)* 4(nTX0RTS)* 5(nTX1RTS)* 6(NC)* 7(nTX2RTS)* 11(nRX1BF)* 12(nRX0BF)* 15(NC)*; IC19 5(vREF)*; IC20 5(NC)* 10(NC)* 12(NC)* 14(NC)*; X2 S1(SHIELD)* S2(SHIELD)* S3(SHIELD)* S4(SHIELD)* U1(DCD)* U4(DTR)* U5(GND)* U8(CTS)*

### Buses and harness runs
bus SSP[0..4]
bus SSP_SODIMM[0..4] = port SSP_SODIMM[0..4]

### Notes on the sheet
- (near JP26) 2.54mm Male
- CAN Connector
- (near JP27) 2.54mm Male
- Title
- Size:
- Date:
- A3
- Number:
- Time:
- Revision:
- Sheet
- of
- File:
- (in symbol C-TA-1uF-10V-20%-3216) +
- (in symbol C-TA-4.7uF-10V-20%-3216) +
- (in symbol CON-Samtec-SSW-110-01-G-S, part 31) 31 of 50
- (in symbol CON-Samtec-SSW-110-01-G-S, part 32) 32 of 50
- (in symbol CON-Samtec-SSW-110-01-G-S, part 33) 33 of 50
- (in symbol CON-Samtec-SSW-110-01-G-S, part 34) 34 of 50
- (in symbol CON-Samtec-SSW-110-01-G-S, part 35) 35 of 50
- (in symbol CON-Samtec-TSW-110-07-G-D, part 31) 31 of 50
- (in symbol CON-Samtec-TSW-110-07-G-D, part 32) 32 of 50
- (in symbol CON-Samtec-TSW-110-07-G-D, part 33) 33 of 50
- (in symbol CON-Samtec-TSW-110-07-G-D, part 34) 34 of 50
- (in symbol CON-Samtec-TSW-110-07-G-D, part 35) 35 of 50
- (in symbol CON-Tyco-1473005-1-200-0.6mm, part F) Colibri - SSP/CAN; 6 of 16

### Library data of the parts
C158-C161 = C-X7R-100nF-16V-10%-0603: Capacitor Ceramic X7R 100nF 16V 10% 0603; Tolerance: 10%; Type: X7R; Value: 100nF
C162 C163 = C-NPO-22pF-50V-5%-0603: Capacitor Ceramic NPO 22pF 50V 5% 0603; Tolerance: 5%; Type: NPO; Value: 22pF
C164 = C-TA-4.7uF-10V-20%-3216: Capacitor TA 4.7uF 10V 20% 3216; Tolerance: 20%; Type: TA; Value: 4.7uF
C165 = C-TA-1uF-10V-20%-3216: Capacitor TA 1uF 10V 20% 3216; Tolerance: 20%; Type: TA; Value: 1uF
IC17 = IC-AD-ADuM1301ARW: Digital Isolator; Manufacturer Name: Analog Devices; Manufacturer Part No.: ADuM1301ARW
IC18 = IC-MC-MCP2515T-I/ST: CAN controller with SPI Interface; Manufacturer Name: Microchip
IC19 = IC-MC-MCP2551T-I/SN: High speed CAN Transceiver; Manufacturer Name: Microchip; Manufacturer Part No.: MCP2551T-I/SN
IC20 = IC-MUR-NTE0505MC-R: Isolated DC/DC Converter; Manufacturer Name: Murata; Manufacturer Part No.: NTE0505MC-R
JP4 JP5 = CON-Samtec-TSW-101-07-G-D_1: Header male, 1x2 Pins, 2.54 mm pitch; Manufacturer Name: Samtec; Pitch: 2.54 mm; No. of ways: 1x2; Manufacturer Part no.: TSW-101-07-G-D
JP26 JP27 = CON-Samtec-TSW-101-07-G-D: as JP28 on sheet Power_Switch; No. of ways: 1x2; Manufacturer Part no.: TSW-101-07-G-D
LED11 = LED-Osram-LS T670-K1L2-1: LED red, Osram LS T670-K1L2-1; Manufacturer Part N.: LS T670-K1L2-1; Manufacturer Name: Osram
LED12 = LED-Osram-T670-K1L2-1: LED green Osram LG T670-K1L2-1; Manufacturer Part N.: LG T670-K1L2-1; Manufacturer Name: Osram
OSC3 = OSC-RAKON-12SMX (B) 30/5020/16-16.0 MHz-30ppm-7.5x5.2mm: Quartz 16.0 MHz; Manufacturer Name: RAKON; Tolerance: 30ppm; Manufacturer Part No.: 12SMX (B) 30/5020/16
R104 R105 = R-120R-63mW-5%-0603: Resistor 120 ohm 63mW 5% 0603; Rating: 63mW; Tolerance: 5%; Value: 120R
R106 R107 = R-0R-63mW-1%-0603: Resistor 0 ohm 63mW 1% 0603; Rating: 63mW; Tolerance: 1%; Value: 0R
R108 = R-100KR-63mW-5%-0603: as R14 on sheet VGA; Rating: 63mW; Tolerance: 5%
R109 = R-100R-63mW-5%-0603: Resistor 100 ohm 63mW 5% 0603; Rating: 63mW; Tolerance: 5%; Value: 100R
RA9 RA11 RA30 = RA-22R-63mW-5%-1206-div: Resistor Array 22 R 63mW 5% 1206; Tolerance: 5%; Power Dissipation: 63mW; Value: 22R
X1 = CON-Tyco-1473005-1-200-0.6mm: as X1 on sheet Analog_IOs
X2 = CON-NorComp-178-009-613R571: RS232 Connector 9 pins male; No. of Ways: 18; Manufacturer Name: NorComp; Manufacturer Part No.: 178-009-613R571
X10 X12 = CON-Samtec-SSW-110-01-G-S: as X10 on sheet Analog_IOs; Pitch: 2.54mm; No. of ways: 1x50; Manufacturer Part No.: SSW-110-01-G-S
X11 = CON-Samtec-TSW-110-07-G-D: as X11 on sheet Analog_IOs; Pitch: 2.54mm; No. of ways: 2x50; Manufacturer Part No.: TSW-110-07-G-D
X38 = CON-Samtec-SSW-102-01-G-S: Receptacle Female, 1x2 Pins, 2.54 mm pitch; Manufacturer Name: Samtec; Pitch: 2.54 mm; No. of ways: 1x2; Manufacturer Part no.: SSW-102-01-G-S

## Sheet JTAG.SchDoc: Evaluation Board 3.2
size A3; Organization: Toradex AG; Address1: Altsagenstrasse 5; Address2: Horw; Address3: 6048; Address4: Switzerland; DocumentNumber: 20; Revision: V3.2; SheetNumber: 20; SheetTotal: 23; PageSetup: Record=PageOptions|CenterHorizontal=True|CenterVertical=True|PrintScale=0.73|XCorrection=1.00|YCorrection=1.00|PrintKind=0|BorderSize=5000000|LeftOffset=0|BottomOffset=0|Orientation=2|PaperLength=1000|PaperWidth=1000|Scale=100|PaperSource=7|PrintQuality=-4|MediaType=1|DitherType=10|PaperKind=A4|PrintScaleMode=1
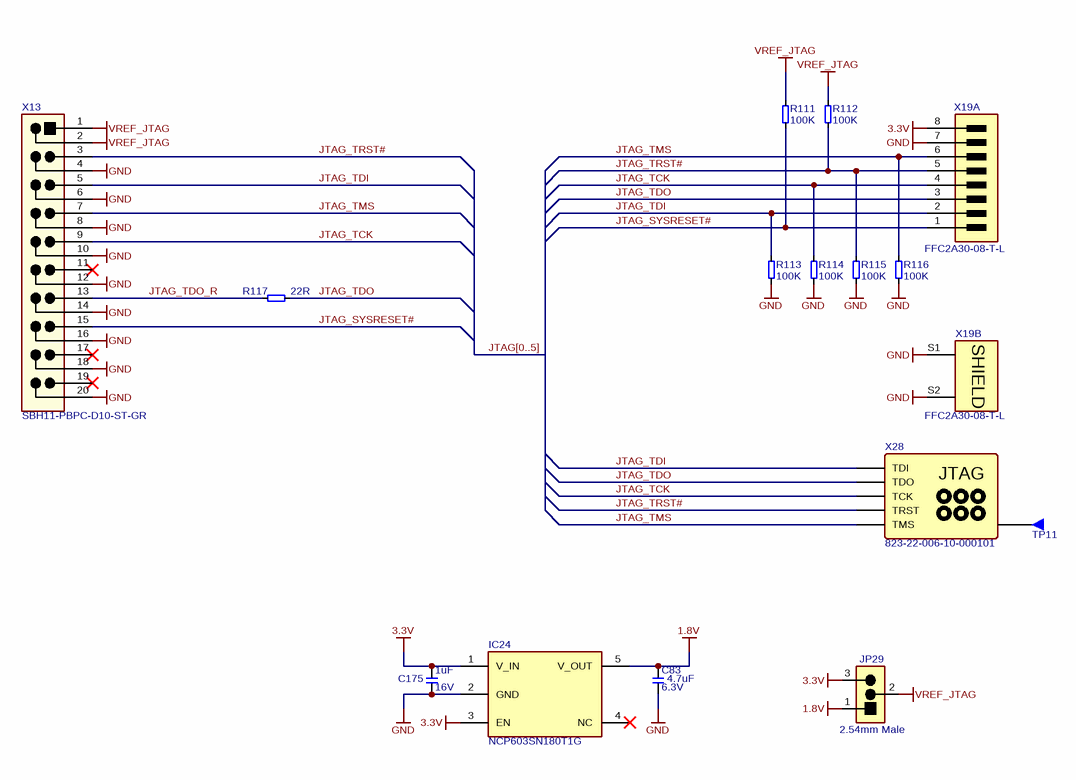
[diagram p14: JTAG.SchDoc]

### Parts
C83  Rating: 6.3V  [T_CAPC0603X33N]  (hidden comment: 4.7uF)
C175  Rating: 16V  [T_CAPC0603X33N]  (hidden comment: 1uF)
IC24  NCP603SN180T1G  [T_ON_NCP603SN180T1G]
JP29  826936-3  [T_TYCO_826936-3]  (value not drawn)
R111  100K  [T_RESC0603X30N]
R112  100K  [T_RESC0603X30N]
R113  100K  [T_RESC0603X30N]
R114  100K  [T_RESC0603X30N]
R115  100K  [T_RESC0603X30N]
R116  100K  [T_RESC0603X30N]
R117  22R  [T_RESC0603X30N]
TP11  Testpin  [T_TP-THT]  (value not drawn)
X13  SBH11-PBPC-D10-ST-GR  [T_Sullins_SBH11-PBPC-D10-ST-GR]
X19  FFC2A30-08-T-L  [T_GCT_FFC2A30-08-T-L]  (parts A,B of 2)
X28  Manufacturer Part No.: 823-22-006-10-000101  [T_MILL-MAX_823-22-006-10-000101]  (hidden comment: CON-MM-823-22-006-10-000101)

### Nets
1.8V: C83.2 IC24.5(V_OUT) JP29.1
3.3V: C175.2 IC24.1(V_IN) IC24.3(EN) JP29.3 X19.8
GND: C83.1 C175.1 IC24.2(GND) R113.1 R114.1 R115.1 R116.1 X13.4 X13.6 X13.8 X13.10 X13.12 X13.14 X13.16 X13.18 X13.20 X19.7 X19.S1(SHIELD) X19.S2(SHIELD)
VREF_JTAG: JP29.2 R111.2 R112.2 X13.1 X13.2
JTAG_SYSRESET#: R111.1 X13.15 X19.1
JTAG_TCK: R114.2 X13.9 X19.4 X28.3(TCK)
JTAG_TDI: R113.2 X13.5 X19.2 X28.1(TDI)
JTAG_TDO: R117.2 X19.3 X28.2(TDO)
JTAG_TDO_R: R117.1 X13.13
JTAG_TMS: R116.2 X13.7 X19.6 X28.5(TMS)
JTAG_TRST#: R112.1 R115.2 X13.3 X19.5 X28.4(TRST)
NetTP11_1: TP11.1 X28.6

Not connected (* = marked no-connect by the designer): IC24 4(NC)*; X13 11* 17* 19*

### Buses and harness runs
bus JTAG[0..5]

### Notes on the sheet
- (near JP29) 2.54mm Male
- Title
- Size:
- Date:
- A3
- Number:
- Time:
- Revision:
- Sheet
- of
- File:
- (in symbol CON-MM-823-22-006-10-000101) JTAG

### Library data of the parts
C83 = C-X5R-4.7uF-6.3V-20%-0603: Capacitor Ceramic X5R 4.7uF 6.3V 20% 0603; Tolerance: 20%; Type: X5R; Value: 4.7uF
C175 = C-X5R-1uF-16V-20%-0603: Capacitor Ceramic X5R 1uF 16V 20% 0603; Tolerance: 20%; Type: X5R; Value: 1uF
IC24 = IC-ON-NCP603SN180T1G: CMOS LDO Regulator; Manufacturer Name: ON; Manufacturer Part No.: NCP603SN180T1G
JP29 = CON-Tyco-826936-3-1X3-2.54mm-JP_1: Jumper, 3-Pin; Manufacturer Name: Tyco; No. of ways: 1X3; Pitch: 2.54mm; Manufacturer Part No.: 826936-3
R111-R116 = R-100KR-63mW-5%-0603: as R14 on sheet VGA; Rating: 63mW; Tolerance: 5%
R117 = R-22R-63mW-5%-0603: Resistor 22 ohm 63mW 5% 0603; Rating: 63mW; Tolerance: 5%; Value: 22R
TP11 = Testpin: Testpin TH
X13 = CON-Sullins-SBH11-PBPC-D10-ST-GR: Header shrouded male, 2x10 pin 2.54mm pitch; Manufacturer Name: Sullins; No. of ways: 2x10; Pitch: 2.54mm; Manufacturer Part No.: SBH11-PBPC-D10-ST-GR
X19 = CON-GCT-FFC2A30-08-T-L-0.5mm: 0.50mm Pitch FFC/FPC JTAG Connector Vertical; Manufacturer Name: GCT; No. of ways: 8; Pitch: 0.5mm; Manufacturer Part No.: FFC2A30-08-T-L
X28 = CON-MM-823-22-006-10-000101: JTAG Pogo pins; Manufacturer Name: Mill-Max

## Sheet LEDs_Switches.SchDoc: Evaluation Board 3.2
size A3; Organization: Toradex AG; Address1: Altsagenstrasse 5; Address2: Horw; Address3: 6048; Address4: Switzerland; DocumentNumber: 21; Revision: V3.2; SheetNumber: 21; SheetTotal: 23; PageSetup: Record=PageOptions|CenterHorizontal=True|CenterVertical=True|PrintScale=0.73|XCorrection=1.00|YCorrection=1.00|PrintKind=0|BorderSize=5000000|LeftOffset=0|BottomOffset=0|Orientation=2|PaperLength=1000|PaperWidth=1000|Scale=100|PaperSource=7|PrintQuality=-4|MediaType=1|DitherType=10|PaperKind=A4|PrintScaleMode=1
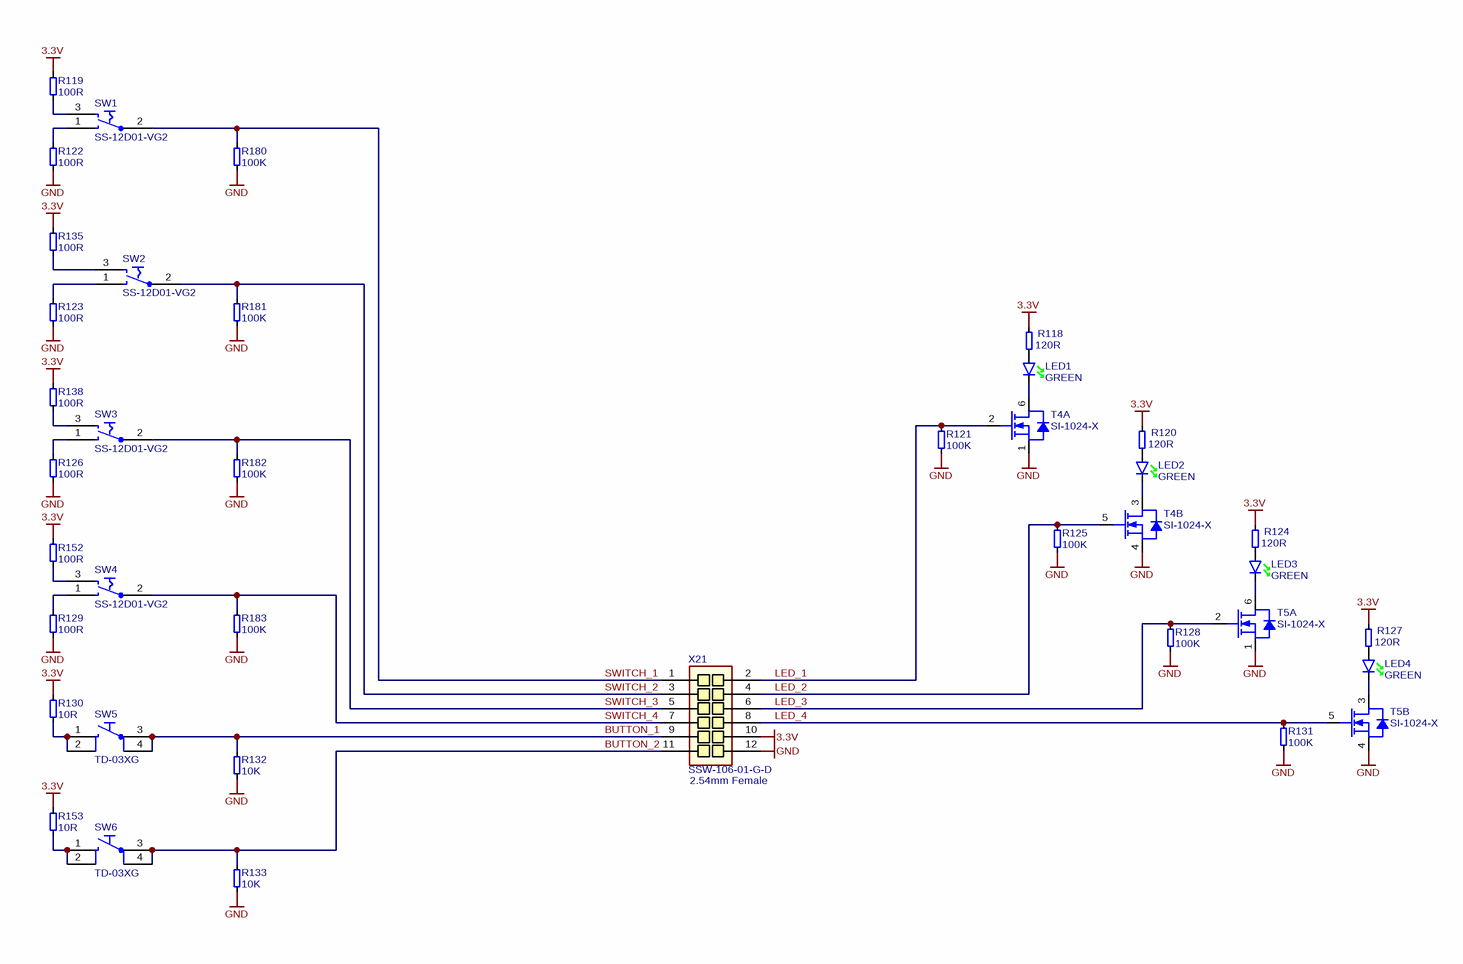
[diagram p15: LEDs_Switches.SchDoc]

### Parts
LED1  Color: GREEN  [T_Osram_T670_GREEN]  (hidden comment: LG T670-K1L2-1)
LED2  Color: GREEN  [T_Osram_T670_GREEN]  (hidden comment: LG T670-K1L2-1)
LED3  Color: GREEN  [T_Osram_T670_GREEN]  (hidden comment: LG T670-K1L2-1)
LED4  Color: GREEN  [T_Osram_T670_GREEN]  (hidden comment: LG T670-K1L2-1)
R118  120R  [T_RESC0603X30N]
R119  100R  [T_RESC0603X30N]
R120  120R  [T_RESC0603X30N]
R121  100K  [T_RESC0603X30N]
R122  100R  [T_RESC0603X30N]
R123  100R  [T_RESC0603X30N]
R124  120R  [T_RESC0603X30N]
R125  100K  [T_RESC0603X30N]
R126  100R  [T_RESC0603X30N]
R127  120R  [T_RESC0603X30N]
R128  100K  [T_RESC0603X30N]
R129  100R  [T_RESC0603X30N]
R130  10R  [T_RESC0603X30N]
R131  100K  [T_RESC0603X30N]
R132  10K  [T_RESC0603X30N]
R133  10K  [T_RESC0603X30N]
R135  100R  [T_RESC0603X30N]
R138  100R  [T_RESC0603X30N]
R152  100R  [T_RESC0603X30N]
R153  10R  [T_RESC0603X30N]
R180  100K  [T_RESC0603X30N]
R181  100K  [T_RESC0603X30N]
R182  100K  [T_RESC0603X30N]
R183  100K  [T_RESC0603X30N]
SW1  SS-12D01-VG2  [T_See-Plus_SS-12D01-VG2]
SW2  SS-12D01-VG2  [T_See-Plus_SS-12D01-VG2]
SW3  SS-12D01-VG2  [T_See-Plus_SS-12D01-VG2]
SW4  SS-12D01-VG2  [T_See-Plus_SS-12D01-VG2]
SW5  TD-03XG  [T_WMF_TD-03XG]
SW6  TD-03XG  [T_WMF_TD-03XG]
T4  Manufacturer Part No.: SI-1024-X  [SOTFL50P160X60-6N]  (hidden comment: T-Vishay-SI-1024X-N)  (parts A,B of 2)
T5  Manufacturer Part No.: SI-1024-X  [SOTFL50P160X60-6N]  (hidden comment: T-Vishay-SI-1024X-N)  (parts A,B of 2)
X21  SSW-106-01-G-D  [T_Samtec_SSW-106-01-G-D]

### Nets
3.3V: R118.2 R119.2 R120.2 R124.2 R127.2 R130.2 R135.2 R138.2 R152.2 R153.2 X21.10
GND: R121.1 R122.1 R123.1 R125.1 R126.1 R128.1 R129.1 R131.1 R132.1 R133.1 R180.1 R181.1 R182.1 R183.1 T4.1(S) T4.4(S) T5.1(S) T5.4(S) X21.12
BUTTON_1: R132.2 SW5.3 SW5.4 X21.9
BUTTON_2: R133.2 SW6.3 SW6.4 X21.11
LED_1: R121.2 T4.2(G) X21.2
LED_2: R125.2 T4.5(G) X21.4
LED_3: R128.2 T5.2(G) X21.6
LED_4: R131.2 T5.5(G) X21.8
SWITCH_1: R180.2 SW1.2 X21.1
SWITCH_2: R181.2 SW2.2 X21.3
SWITCH_3: R182.2 SW3.2 X21.5
SWITCH_4: R183.2 SW4.2 X21.7
NetLED1_A: LED1.A R118.1
NetLED1_K: LED1.K T4.6(D)
NetLED2_A: LED2.A R120.1
NetLED2_K: LED2.K T4.3(D)
NetLED3_A: LED3.A R124.1
NetLED3_K: LED3.K T5.6(D)
NetLED4_A: LED4.A R127.1
NetLED4_K: LED4.K T5.3(D)
NetR119_1: R119.1 SW1.3
NetR122_2: R122.2 SW1.1
NetR123_2: R123.2 SW2.1
NetR126_2: R126.2 SW3.1
NetR129_2: R129.2 SW4.1
NetR130_1: R130.1 SW5.1 SW5.2
NetR135_1: R135.1 SW2.3
NetR138_1: R138.1 SW3.3
NetR152_1: R152.1 SW4.3
NetR153_1: R153.1 SW6.1 SW6.2

### Notes on the sheet
- (near X21) 2.54mm Female
- Title
- Size:
- Date:
- A3
- Number:
- Time:
- Revision:
- Sheet
- of
- File:

### Library data of the parts
LED1-LED4 = LED-Osram-T670-K1L2-1: LED green Osram LG T670-K1L2-1; Manufacturer Part N.: LG T670-K1L2-1; Manufacturer Name: Osram
R118 R120 R124 R127 = R-120R-63mW-5%-0603: Resistor 120 ohm 63mW 5% 0603; Rating: 63mW; Tolerance: 5%; Value: 120R
R119 R122 R123 R126 R129 R135 R138 R152 = R-100R-63mW-5%-0603: Resistor 100 ohm 63mW 5% 0603; Rating: 63mW; Tolerance: 5%; Value: 100R
R121 R125 R128 R131 R180-R183 = R-100KR-63mW-5%-0603: as R14 on sheet VGA; Rating: 63mW; Tolerance: 5%
R130 R153 = R-10R-63mW-5%-0603: Resistor 10 ohm 63mW 5% 0603; Rating: 63mW; Tolerance: 5%; Value: 10R
R132 R133 = R-10KR-63mW-5%-0603: as R96-R99 on sheet Analog_IOs; Rating: 63mW; Tolerance: 5%
SW1-SW4 = SW-See-Plus-SS-12D01-VG2: Switch; Rating: 0.3A; Manufacturer Name: See-Plus; Manufacturer Part No.: SS-12D01-VG2
SW5 SW6 = SW-WMF-TD-03XG: as SW7 on sheet Power_Switch; Manufacturer Part No.: TD-03XG
T4 T5 = T-Vishay-SI-1024X-N: as T7 on sheet Power_Switch
X21 = CON-Samtec-SSW-106-01-G-D: Header Female, 2x6 Pins, 2.54 mm pitch; Manufacturer Name: Samtec; Pitch: 2.54mm; No. of wasy: 2x6; Manufacturer Part No.: SSW-106-01-G-D

## Sheet GPIOs.SchDoc: Evaluation Board 3.2
size A3; Organization: Toradex AG; Address1: Altsagenstrasse 5; Address2: Horw; Address3: 6048; Address4: Switzerland; DocumentNumber: 9; Revision: V3.2; SheetNumber: 9; SheetTotal: 23; PageSetup: Record=PageOptions|CenterHorizontal=True|CenterVertical=True|PrintScale=0.73|XCorrection=1.00|YCorrection=1.00|PrintKind=0|BorderSize=5000000|LeftOffset=0|BottomOffset=0|Orientation=2|PaperLength=1000|PaperWidth=1000|Scale=100|PaperSource=7|PrintQuality=-4|MediaType=1|DitherType=10|PaperKind=A4|PrintScaleMode=1
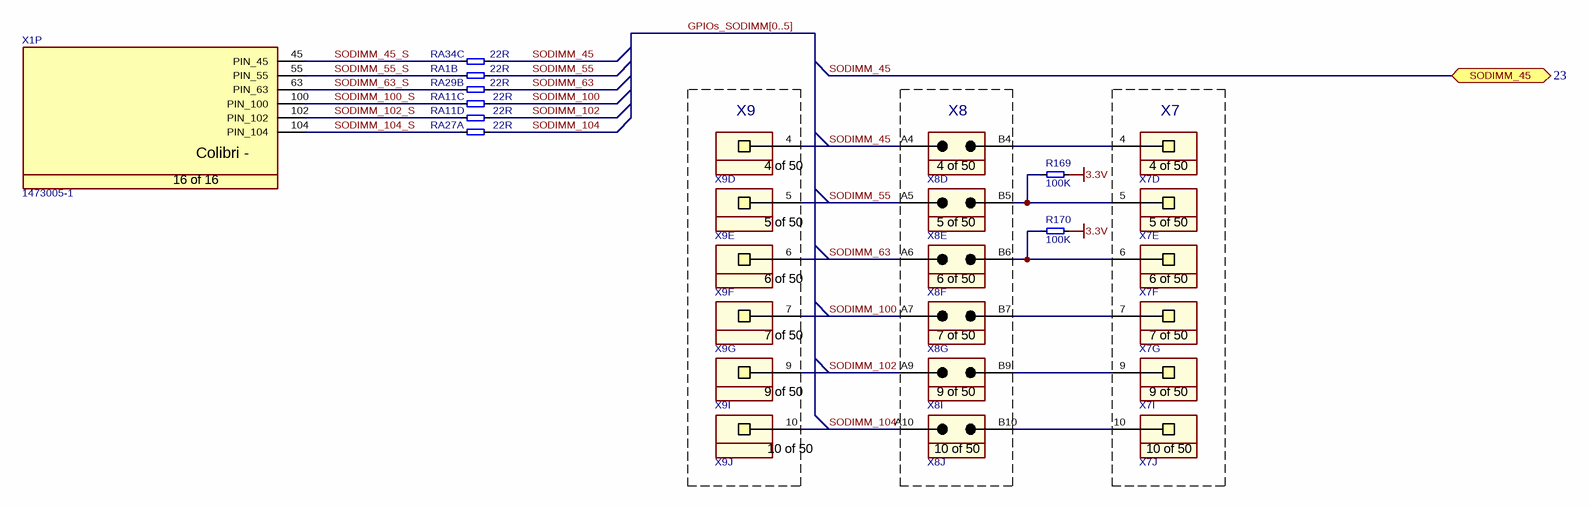
[diagram p16: GPIOs.SchDoc]

### Parts
R169  100K  [T_RESC0603X30N]
R170  100K  [T_RESC0603X30N]
RA1  22R  [T_Resistor_Array_X4]  (part B of 4)
RA11  22R  [T_Resistor_Array_X4]  (parts C,D of 4)
RA27  22R  [T_Resistor_Array_X4]  (part A of 4)
RA29  22R  [T_Resistor_Array_X4]  (part B of 4)
RA34  22R  [T_Resistor_Array_X4]  (part C of 4)
X1  Manufacturer Part No.: 1473005-1  [T_Tyco_1473005-1]  (hidden comment: CON-Tyco-1473005-1-200-0.6mm)  (part P of 16)
X7  SSW-110-01-G-S  [T_Samtec_SSW-110-01-G-S]  (value not drawn)  (parts D,E,F,G,I,J of 50)
X8  TSW-110-07-G-D  [T_Samtec_TSW-110-07-G-D]  (value not drawn)  (parts D,E,F,G,I,J of 50)
X9  SSW-110-01-G-S  [T_Samtec_SSW-110-01-G-S]  (value not drawn)  (parts D,E,F,G,I,J of 50)

### Blocks framed on the sheet
X9: X9
X8: X8
X7: X7

### Ports
SODIMM_45 (bidir, see 23)

### Nets
3.3V: R169.2 R170.2
SODIMM_45: RA34.7 X8.A4 X9.4 ; port SODIMM_45
SODIMM_45_S: RA34.3 X1.45(PIN_45)
SODIMM_55: RA1.6 X8.A5 X9.5
SODIMM_55_S: RA1.2 X1.55(PIN_55)
SODIMM_63: RA29.6 X8.A6 X9.6
SODIMM_63_S: RA29.2 X1.63(PIN_63)
SODIMM_100: RA11.7 X8.A7 X9.7
SODIMM_100_S: RA11.3 X1.100(PIN_100)
SODIMM_102: RA11.8 X8.A9 X9.9
SODIMM_102_S: RA11.4 X1.102(PIN_102)
SODIMM_104: RA27.5 X8.A10 X9.10
SODIMM_104_S: RA27.1 X1.104(PIN_104)
NetR169_1: R169.1 X7.5 X8.B5
NetR170_1: R170.1 X7.6 X8.B6
NetX7_4: X7.4 X8.B4
NetX7_7: X7.7 X8.B7
NetX7_9: X7.9 X8.B9
NetX7_10: X7.10 X8.B10

### Buses and harness runs
bus GPIOs_SODIMM[0..5]

### Notes on the sheet
- Title
- Size:
- Date:
- A3
- Number:
- Time:
- Revision:
- Sheet
- of
- File:
- (in symbol CON-Samtec-SSW-110-01-G-S, part D) 4 of 50
- (in symbol CON-Samtec-SSW-110-01-G-S, part E) 5 of 50
- (in symbol CON-Samtec-SSW-110-01-G-S, part F) 6 of 50
- (in symbol CON-Samtec-SSW-110-01-G-S, part G) 7 of 50
- (in symbol CON-Samtec-SSW-110-01-G-S, part I) 9 of 50
- (in symbol CON-Samtec-SSW-110-01-G-S, part J) 10 of 50
- (in symbol CON-Samtec-TSW-110-07-G-D, part D) 4 of 50
- (in symbol CON-Samtec-TSW-110-07-G-D, part E) 5 of 50
- (in symbol CON-Samtec-TSW-110-07-G-D, part F) 6 of 50
- (in symbol CON-Samtec-TSW-110-07-G-D, part G) 7 of 50
- (in symbol CON-Samtec-TSW-110-07-G-D, part I) 9 of 50
- (in symbol CON-Samtec-TSW-110-07-G-D, part J) 10 of 50
- (in symbol CON-Tyco-1473005-1-200-0.6mm, part P) Colibri -; 16 of 16

### Library data of the parts
R169 R170 = R-100KR-63mW-5%-0603: as R14 on sheet VGA; Rating: 63mW; Tolerance: 5%
RA1 RA11 RA27 RA29 RA34 = RA-22R-63mW-5%-1206-div: Resistor Array 22 R 63mW 5% 1206; Tolerance: 5%; Power Dissipation: 63mW; Value: 22R
X1 = CON-Tyco-1473005-1-200-0.6mm: as X1 on sheet Analog_IOs
X7 X9 = CON-Samtec-SSW-110-01-G-S: as X10 on sheet Analog_IOs; Pitch: 2.54mm; No. of ways: 1x50; Manufacturer Part No.: SSW-110-01-G-S
X8 = CON-Samtec-TSW-110-07-G-D: as X11 on sheet Analog_IOs; Pitch: 2.54mm; No. of ways: 2x50; Manufacturer Part No.: TSW-110-07-G-D

## Sheet Unified_Interface.SchDoc: Evaluation Board 3.2
size A3; Organization: Toradex AG; Address1: Altsagenstrasse 5; Address2: Horw; Address3: 6048; Address4: Switzerland; DocumentNumber: 16; Revision: V3.2; SheetNumber: 16; SheetTotal: 23; PageSetup: Record=PageOptions|CenterHorizontal=True|CenterVertical=True|PrintScale=0.73|XCorrection=1.00|YCorrection=1.00|PrintKind=0|BorderSize=5000000|LeftOffset=0|BottomOffset=0|Orientation=2|PaperLength=1000|PaperWidth=1000|Scale=100|PaperSource=7|PrintQuality=-4|MediaType=1|DitherType=10|PaperKind=A4|PrintScaleMode=1
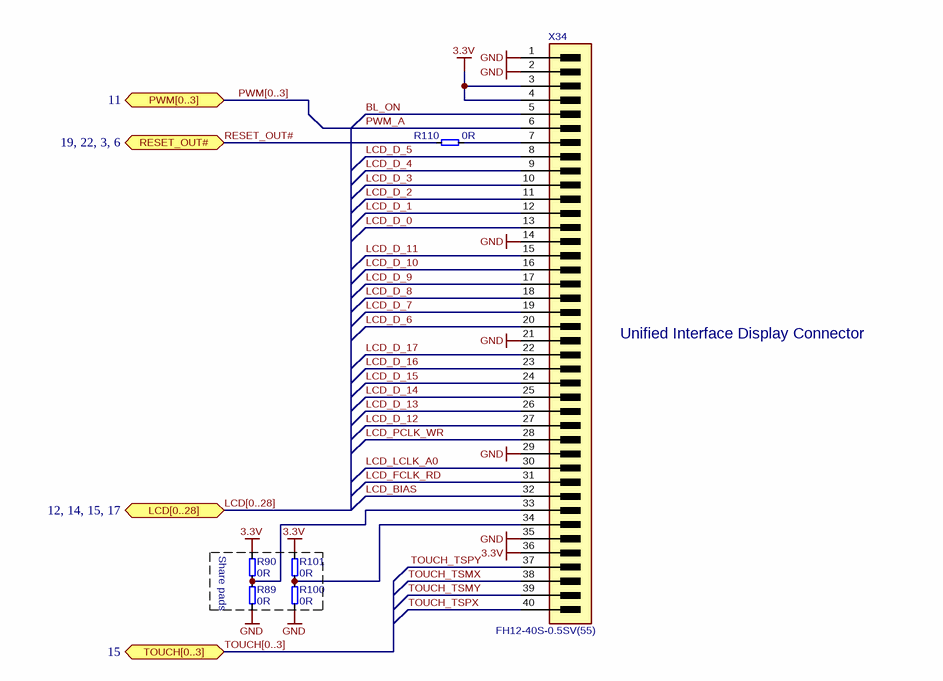
[diagram p17: Unified_Interface.SchDoc]

### Parts
R89  0R  [T_RESC0603X30N]
R90  0R  [T_RESC0603X30N]
R100  0R  [T_RESC0603X30N]
R101  0R  [T_RESC0603X30N]
R110  0R  [T_RESC0603X30N]
X34  FH12-40S-0.5SV(55)  [T_Hirose_FH12-40S-0.5SV(55)]

### Blocks framed on the sheet
Share pads: R89 R90 R100 R101

### Ports
LCD[0..28] (bidir, see 12, 14, 15, 17), PWM[0..3] (bidir, see 11), RESET_OUT# (bidir, see 19, 22, 3, 6), TOUCH[0..3] (bidir, see 15)

### Nets
3.3V: R90.1 R101.2 X34.3(VCC) X34.4(VCC) X34.36(VDD)
GND: R89.2 R100.2 X34.1(VSS) X34.2(VSS) X34.14(VSS) X34.21(VSS) X34.29(VSS) X34.35(VSS)
BL_ON: X34.5(PWCTRL)
LCD_BIAS: X34.32(ENB)
LCD_D_0: X34.13(B0)
LCD_D_1: X34.12(B1)
LCD_D_2: X34.11(B2)
LCD_D_3: X34.10(B3)
LCD_D_4: X34.9(B4)
LCD_D_5: X34.8(B5)
LCD_D_6: X34.20(G0)
LCD_D_7: X34.19(G1)
LCD_D_8: X34.18(G2)
LCD_D_9: X34.17(G3)
LCD_D_10: X34.16(G4)
LCD_D_11: X34.15(G5)
LCD_D_12: X34.27(R0)
LCD_D_13: X34.26(R1)
LCD_D_14: X34.25(R2)
LCD_D_15: X34.24(R3)
LCD_D_16: X34.23(R4)
LCD_D_17: X34.22(R5)
LCD_FCLK_RD: X34.31(VSYNC)
LCD_LCLK_A0: X34.30(HSYNC)
LCD_PCLK_WR: X34.28(DCLK)
PWM_A: X34.6(LEDCTRL)
RESET_OUT#: R110.1 ; port RESET_OUT#
TOUCH_TSMX: X34.38(XR)
TOUCH_TSMY: X34.39(YD)
TOUCH_TSPX: X34.40(XL)
TOUCH_TSPY: X34.37(YU)
NetR89_1: R89.1 R90.2 X34.33(NC)
NetR100_1: R100.1 R101.1 X34.34(SHUT)
NetR110_2: R110.2 X34.7(RESET#)

### Buses and harness runs
bus LCD[0..28] = port LCD[0..28]
bus PWM[0..3] = port PWM[0..3]
bus TOUCH[0..3] = port TOUCH[0..3]

### Notes on the sheet
- Unified Interface Display Connector
- Title
- Size:
- Date:
- A3
- Number:
- Time:
- Revision:
- Sheet
- of
- File:

### Library data of the parts
R89 R90 R100 R101 R110 = R-0R-63mW-1%-0603: Resistor 0 ohm 63mW 1% 0603; Rating: 63mW; Tolerance: 1%; Value: 0R
X34 = CON-Hirose-FH12-40S-0.5SV(55)-0.5mm: 0.50mm Pitch FFC/FPC Vertical RGB connector; Manufacturer Name: Hirose; No. of ways: 24; Pitch: 0.5mm; Manufacturer Part No.: FH12-40S-0.5SV(55)